# Altium project ZynQ-Feather r0.2.PrjPCB (part 1 of 2)
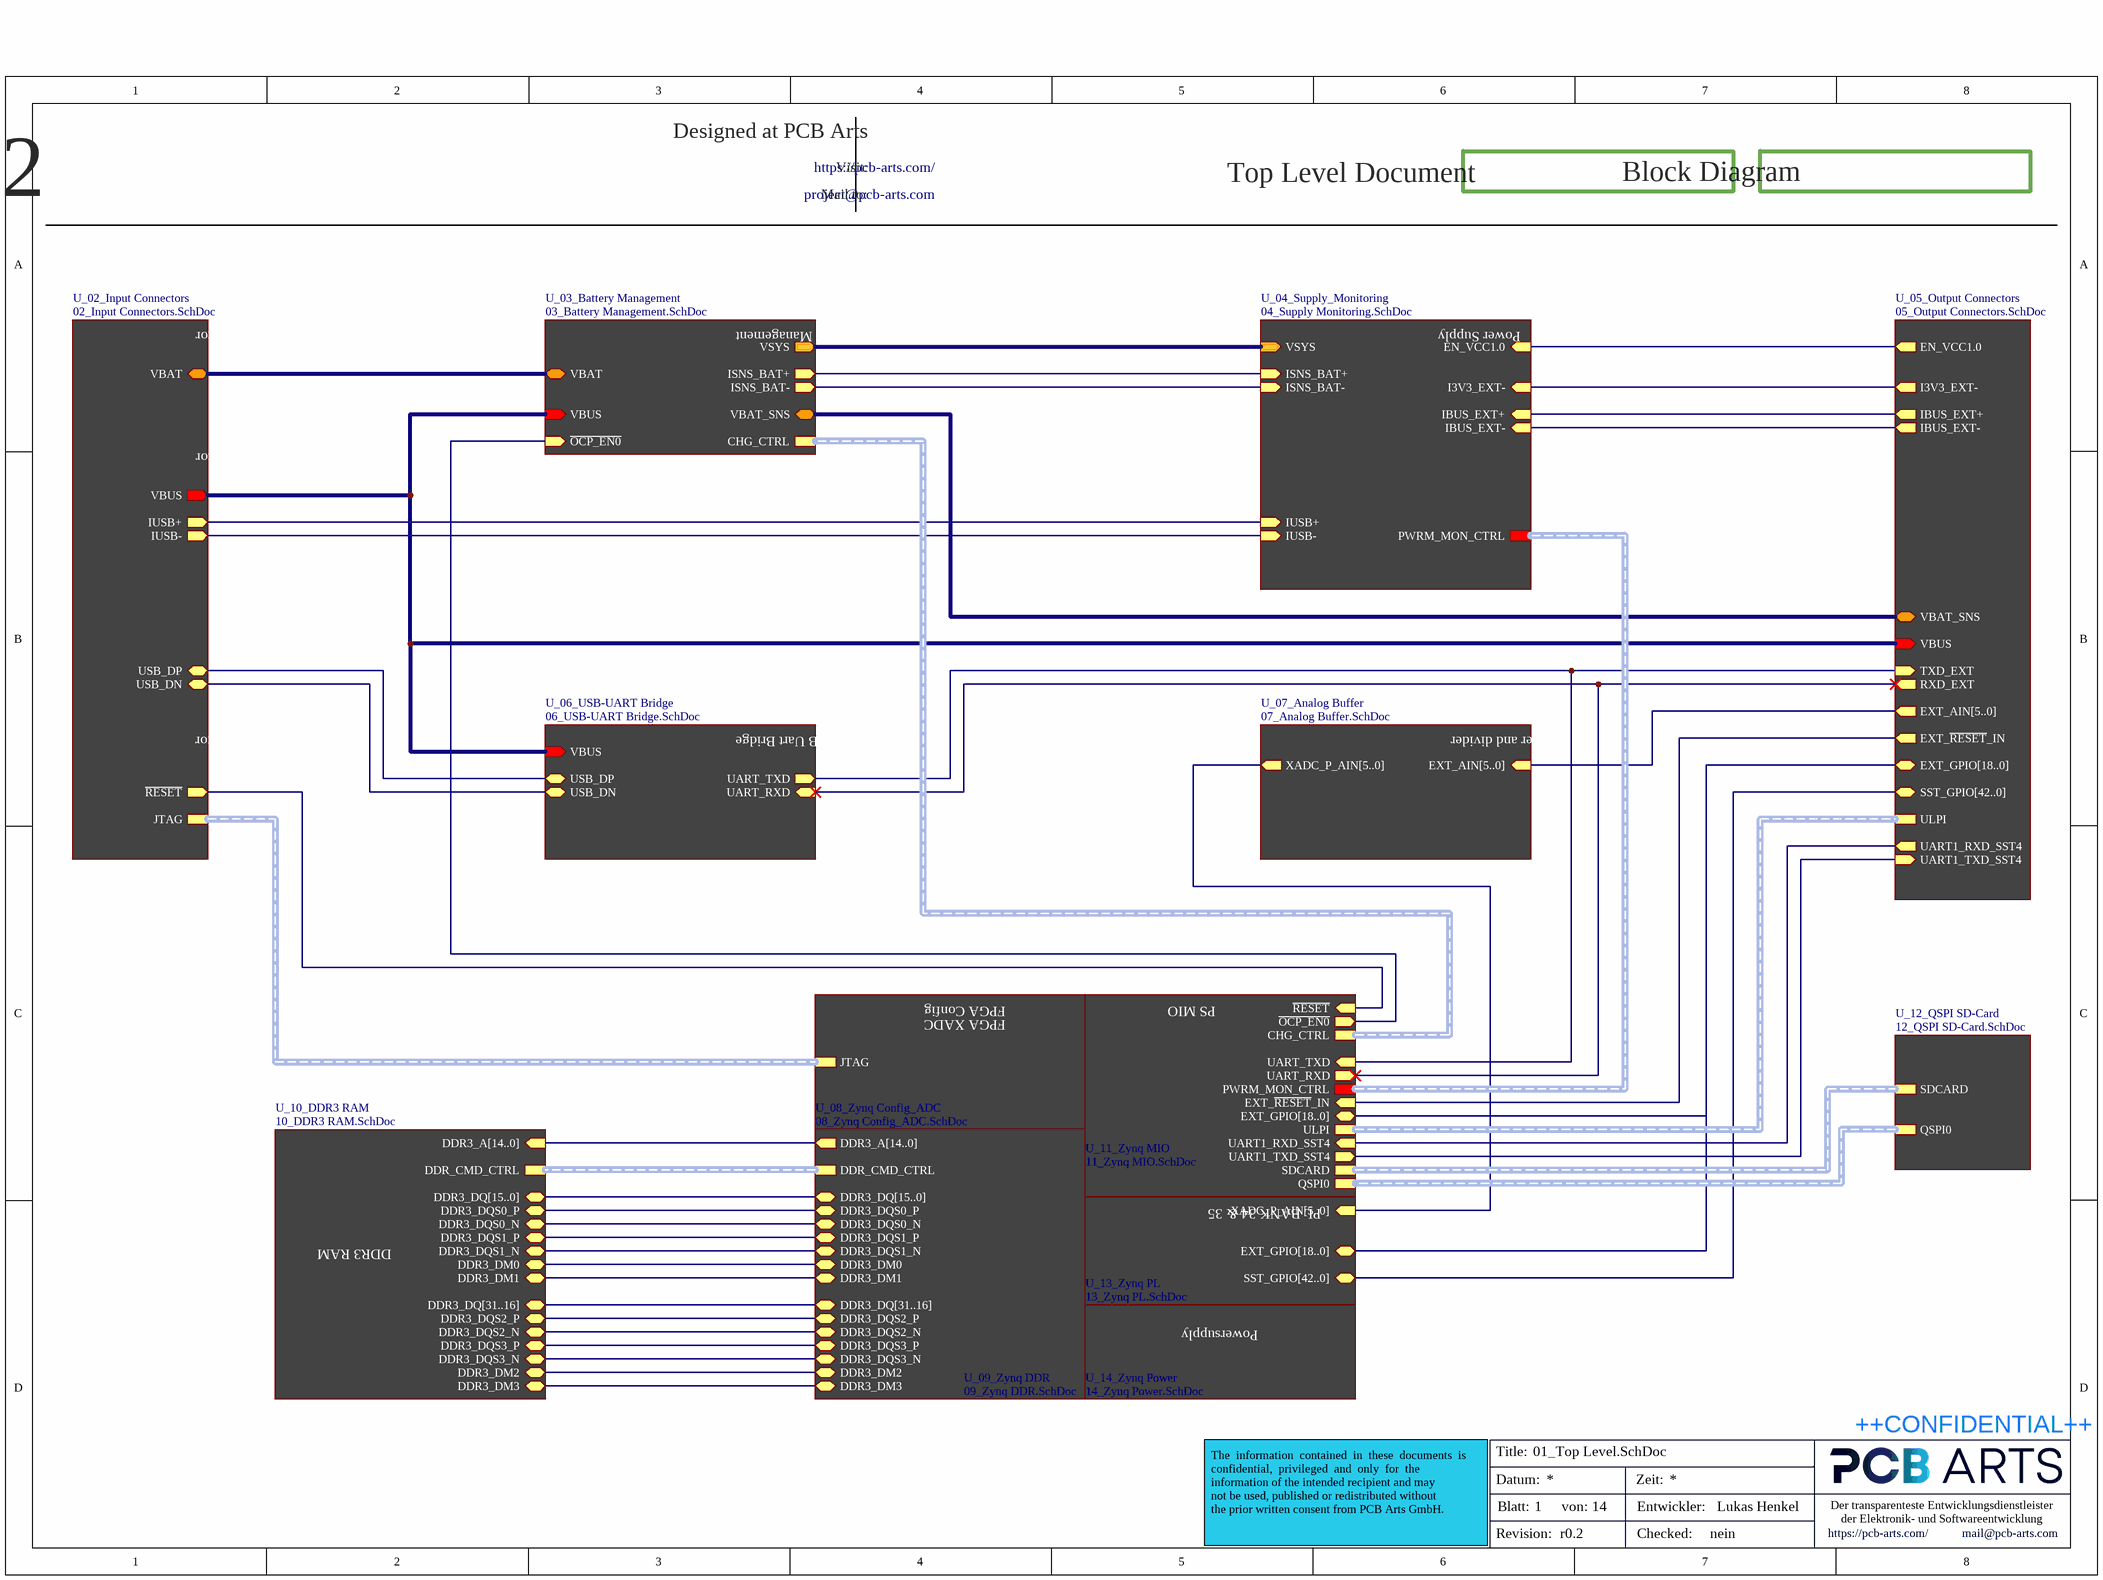
[diagram p0: 01_Top Level.SchDoc]
Checked: nein; Entwickler: Lukas Henkel; Revision1: r0.2
14 sheets, 293 parts. Net scope: hierarchical (ports join the sheet entries above them; power ports are global).
Board files: Zynq Feather r0.2.PcbDoc, Zynq Feather r0.2 Panel.PcbDoc
Sheets:
  01_Top Level.SchDoc
    U_02_Input Connectors = 02_Input Connectors.SchDoc
    U_03_Battery Management = 03_Battery Management.SchDoc
    U_04_Supply_Monitoring = 04_Supply Monitoring.SchDoc
    U_05_Output Connectors = 05_Output Connectors.SchDoc
    U_06_USB-UART Bridge = 06_USB-UART Bridge.SchDoc
    U_07_Analog Buffer = 07_Analog Buffer.SchDoc
    U_08_Zynq Config_ADC = 08_Zynq Config_ADC.SchDoc
    U_09_Zynq DDR = 09_Zynq DDR.SchDoc
    U_10_DDR3 RAM = 10_DDR3 RAM.SchDoc
    U_12_QSPI SD-Card = 12_QSPI SD-Card.SchDoc
    U_11_Zynq MIO = 11_Zynq MIO.SchDoc
    U_13_Zynq PL = 13_Zynq PL.SchDoc
    U_14_Zynq Power = 14_Zynq Power.SchDoc

## Sheet 01_Top Level.SchDoc
size A3; SheetNumber: 1; SheetTotal: 14

### Sub-sheets
U_02_Input Connectors = 02_Input Connectors.SchDoc: USB_DP (bidir), USB_DN (bidir), VBUS (out), VBAT (bidir), JTAG (harness JTAG), IUSB- (out), IUSB+ (out), ~{RESET} (out)
U_03_Battery Management = 03_Battery Management.SchDoc: VBUS (in), VBAT (bidir), VSYS (out), ISNS_BAT+ (out), ISNS_BAT- (out), VBAT_SNS (bidir), CHG_CTRL (harness CHG_CTRL), ~{OCP_EN0} (in)
U_04_Supply_Monitoring = 04_Supply Monitoring.SchDoc: EN_VCC1.0 (in), VSYS (in), PWRM_MON_CTRL (harness PWRM_MON_CTRL), ISNS_BAT+ (in), ISNS_BAT- (in), IBUS_EXT+ (in), IBUS_EXT- (in), IUSB- (in), IUSB+ (in), I3V3_EXT- (in)
U_05_Output Connectors = 05_Output Connectors.SchDoc: I3V3_EXT- (out), VBUS (in), IBUS_EXT+ (out), IBUS_EXT- (out), EN_VCC1.0 (out), VBAT_SNS (bidir), EXT_~{RESET}_IN (out), RXD_EXT (out), TXD_EXT (in), EXT_GPIO[18..0] (bidir), EXT_AIN[5..0] (out), SST_GPIO[42..0] (bidir), ULPI (harness ULPI), UART1_RXD_SST4 (out), UART1_TXD_SST4 (in)
U_06_USB-UART Bridge = 06_USB-UART Bridge.SchDoc: USB_DP (bidir), USB_DN (bidir), UART_TXD (out), UART_RXD (in), VBUS (in)
U_07_Analog Buffer = 07_Analog Buffer.SchDoc: EXT_AIN[5..0] (in), XADC_P_AIN[5..0] (out)
U_08_Zynq Config_ADC = 08_Zynq Config_ADC.SchDoc: JTAG (harness JTAG)
U_09_Zynq DDR = 09_Zynq DDR.SchDoc: DDR3_DQ[15..0] (bidir), DDR3_DQ[31..16] (bidir), DDR3_DQS0_P (bidir), DDR3_DQS0_N (bidir), DDR3_DQS1_P (bidir), DDR3_DQS1_N (bidir), DDR3_DQS2_P (bidir), DDR3_DQS2_N (bidir), DDR3_DQS3_P (bidir), DDR3_DQS3_N (bidir), DDR3_DM0 (bidir), DDR3_DM1 (bidir), DDR3_DM2 (bidir), DDR3_DM3 (bidir), DDR3_A[14..0] (out), DDR_CMD_CTRL (harness DDR_CMD_CTRL)
U_10_DDR3 RAM = 10_DDR3 RAM.SchDoc: DDR3_A[14..0] (in), DDR3_DQ[15..0] (bidir), DDR3_DQ[31..16] (bidir), DDR3_DQS0_P (bidir), DDR3_DQS0_N (bidir), DDR3_DQS1_P (bidir), DDR3_DQS1_N (bidir), DDR3_DQS2_P (bidir), DDR3_DQS2_N (bidir), DDR3_DQS3_P (bidir), DDR3_DQS3_N (bidir), DDR3_DM0 (bidir), DDR3_DM1 (bidir), DDR3_DM2 (bidir), DDR3_DM3 (bidir), DDR_CMD_CTRL (harness DDR_CMD_CTRL)
U_11_Zynq MIO = 11_Zynq MIO.SchDoc: ~{RESET} (in), UART_TXD (in), UART_RXD (out), PWRM_MON_CTRL (harness PWRM_MON_CTRL), EXT_~{RESET}_IN (in), EXT_GPIO[18..0] (bidir), SDCARD (harness SDCARD), QSPI0 (harness QSPI0), ULPI (harness ULPI), UART1_RXD_SST4 (in), UART1_TXD_SST4 (out), CHG_CTRL (harness CHG_CTRL), ~{OCP_EN0} (out)
U_12_QSPI SD-Card = 12_QSPI SD-Card.SchDoc: SDCARD (harness SDCARD), QSPI0 (harness QSPI0)
U_13_Zynq PL = 13_Zynq PL.SchDoc: EXT_GPIO[18..0] (bidir), XADC_P_AIN[5..0] (in), SST_GPIO[42..0] (bidir)
U_14_Zynq Power = 14_Zynq Power.SchDoc: no entries

### Nets
VSYS: sheet U_03_Battery Management/VSYS, sheet U_04_Supply_Monitoring/VSYS
DDR3_DM0: sheet U_09_Zynq DDR/DDR3_DM0, sheet U_10_DDR3 RAM/DDR3_DM0
DDR3_DM1: sheet U_09_Zynq DDR/DDR3_DM1, sheet U_10_DDR3 RAM/DDR3_DM1
DDR3_DM2: sheet U_09_Zynq DDR/DDR3_DM2, sheet U_10_DDR3 RAM/DDR3_DM2
DDR3_DM3: sheet U_09_Zynq DDR/DDR3_DM3, sheet U_10_DDR3 RAM/DDR3_DM3
DDR3_DQS0_N: sheet U_09_Zynq DDR/DDR3_DQS0_N, sheet U_10_DDR3 RAM/DDR3_DQS0_N
DDR3_DQS0_P: sheet U_09_Zynq DDR/DDR3_DQS0_P, sheet U_10_DDR3 RAM/DDR3_DQS0_P
DDR3_DQS1_N: sheet U_09_Zynq DDR/DDR3_DQS1_N, sheet U_10_DDR3 RAM/DDR3_DQS1_N
DDR3_DQS1_P: sheet U_09_Zynq DDR/DDR3_DQS1_P, sheet U_10_DDR3 RAM/DDR3_DQS1_P
DDR3_DQS2_N: sheet U_09_Zynq DDR/DDR3_DQS2_N, sheet U_10_DDR3 RAM/DDR3_DQS2_N
DDR3_DQS2_P: sheet U_09_Zynq DDR/DDR3_DQS2_P, sheet U_10_DDR3 RAM/DDR3_DQS2_P
DDR3_DQS3_N: sheet U_09_Zynq DDR/DDR3_DQS3_N, sheet U_10_DDR3 RAM/DDR3_DQS3_N
DDR3_DQS3_P: sheet U_09_Zynq DDR/DDR3_DQS3_P, sheet U_10_DDR3 RAM/DDR3_DQS3_P
EN_VCC1.0: sheet U_04_Supply_Monitoring/EN_VCC1.0, sheet U_05_Output Connectors/EN_VCC1.0
EXT_~{RESET}_IN: sheet U_05_Output Connectors/EXT_~{RESET}_IN, sheet U_11_Zynq MIO/EXT_~{RESET}_IN
~{OCP_EN0}: sheet U_03_Battery Management/~{OCP_EN0}, sheet U_11_Zynq MIO/~{OCP_EN0}
~{RESET}: sheet U_02_Input Connectors/~{RESET}, sheet U_11_Zynq MIO/~{RESET}
UART1_RXD_SST4: sheet U_05_Output Connectors/UART1_RXD_SST4, sheet U_11_Zynq MIO/UART1_RXD_SST4
UART1_TXD_SST4: sheet U_05_Output Connectors/UART1_TXD_SST4, sheet U_11_Zynq MIO/UART1_TXD_SST4
UART_RXD: sheet U_05_Output Connectors/RXD_EXT, sheet U_06_USB-UART Bridge/UART_RXD, sheet U_11_Zynq MIO/UART_RXD
UART_TXD: sheet U_05_Output Connectors/TXD_EXT, sheet U_06_USB-UART Bridge/UART_TXD, sheet U_11_Zynq MIO/UART_TXD
USB_D_N: sheet U_02_Input Connectors/USB_DN, sheet U_06_USB-UART Bridge/USB_DN
USB_D_P: sheet U_02_Input Connectors/USB_DP, sheet U_06_USB-UART Bridge/USB_DP
VBAT: sheet U_02_Input Connectors/VBAT, sheet U_03_Battery Management/VBAT, sheet U_03_Battery Management/ISNS_BAT-, sheet U_04_Supply_Monitoring/ISNS_BAT-
NetC2_1: sheet U_02_Input Connectors/VBUS, sheet U_02_Input Connectors/IUSB-, sheet U_03_Battery Management/VBUS, sheet U_04_Supply_Monitoring/IBUS_EXT+, sheet U_04_Supply_Monitoring/IUSB-, sheet U_05_Output Connectors/VBUS, sheet U_05_Output Connectors/IBUS_EXT+, sheet U_06_USB-UART Bridge/VBUS
NetC23_1: sheet U_04_Supply_Monitoring/I3V3_EXT-, sheet U_05_Output Connectors/I3V3_EXT-
NetC24_1: sheet U_04_Supply_Monitoring/IBUS_EXT-, sheet U_05_Output Connectors/IBUS_EXT-
NetJ4_28: sheet U_03_Battery Management/ISNS_BAT+, sheet U_03_Battery Management/VBAT_SNS, sheet U_04_Supply_Monitoring/ISNS_BAT+, sheet U_05_Output Connectors/VBAT_SNS
NetL1_1: sheet U_02_Input Connectors/IUSB+, sheet U_04_Supply_Monitoring/IUSB+

### Buses and harness runs
bus sheet U_05_Output Connectors/EXT_AIN[5..0] = sheet U_07_Analog Buffer/EXT_AIN[5..0]
bus sheet U_05_Output Connectors/EXT_GPIO[18..0] = sheet U_11_Zynq MIO/EXT_GPIO[18..0] = sheet U_13_Zynq PL/EXT_GPIO[18..0]
bus sheet U_05_Output Connectors/SST_GPIO[42..0] = sheet U_13_Zynq PL/SST_GPIO[42..0]
bus sheet U_07_Analog Buffer/XADC_P_AIN[5..0] = sheet U_13_Zynq PL/XADC_P_AIN[5..0]
bus sheet U_09_Zynq DDR/DDR3_A[14..0] = sheet U_10_DDR3 RAM/DDR3_A[14..0]
bus sheet U_09_Zynq DDR/DDR3_DQ[15..0] = sheet U_10_DDR3 RAM/DDR3_DQ[15..0]
bus sheet U_09_Zynq DDR/DDR3_DQ[31..16] = sheet U_10_DDR3 RAM/DDR3_DQ[31..16]
harness sheet U_02_Input Connectors/JTAG = sheet U_08_Zynq Config_ADC/JTAG
harness sheet U_03_Battery Management/CHG_CTRL = sheet U_11_Zynq MIO/CHG_CTRL
harness sheet U_04_Supply_Monitoring/PWRM_MON_CTRL = sheet U_11_Zynq MIO/PWRM_MON_CTRL
harness sheet U_05_Output Connectors/ULPI = sheet U_11_Zynq MIO/ULPI
harness sheet U_09_Zynq DDR/DDR_CMD_CTRL = sheet U_10_DDR3 RAM/DDR_CMD_CTRL
harness sheet U_11_Zynq MIO/QSPI0 = sheet U_12_QSPI SD-Card/QSPI0
harness sheet U_11_Zynq MIO/SDCARD = sheet U_12_QSPI SD-Card/SDCARD

### Notes on the sheet
- Zynq Feather Rev. 0.2
- Designed at PCB Arts
- Mail to:
- Visit:
- https://pcb-arts.com/
- project@pcb-arts.com
- Top Level Document
- Block Diagram
- Battery Connector
- Battery Management
- Power Supply
- USB-C Connector
- JTAG Connector
- USB Uart Bridge
- Buffer and divider
- FPGA Config
- FPGA XADC
- PS MIO
- DDR3 RAM
- PL BANK 34 & 35
- Powersupply
- Title:
- ++CONFIDENTIAL++
- Datum:
- Blatt:
- von:
- Zeit:
- Entwickler:
- Der transparenteste Entwicklungsdienstleister
  der Elektronik- und Softwareentwicklung
- The  information  contained  in  these  documents  is  confidential,  privileged  and  only  for  the
  information of the intended recipient and may
  not be used, published or redistributed without
  the prior written consent from PCB Arts GmbH.
- Revision:
- Checked:
- mail@pcb-arts.com

## Sheet 02_Input Connectors.SchDoc
size A3; SheetNumber: 2; SheetTotal: 14
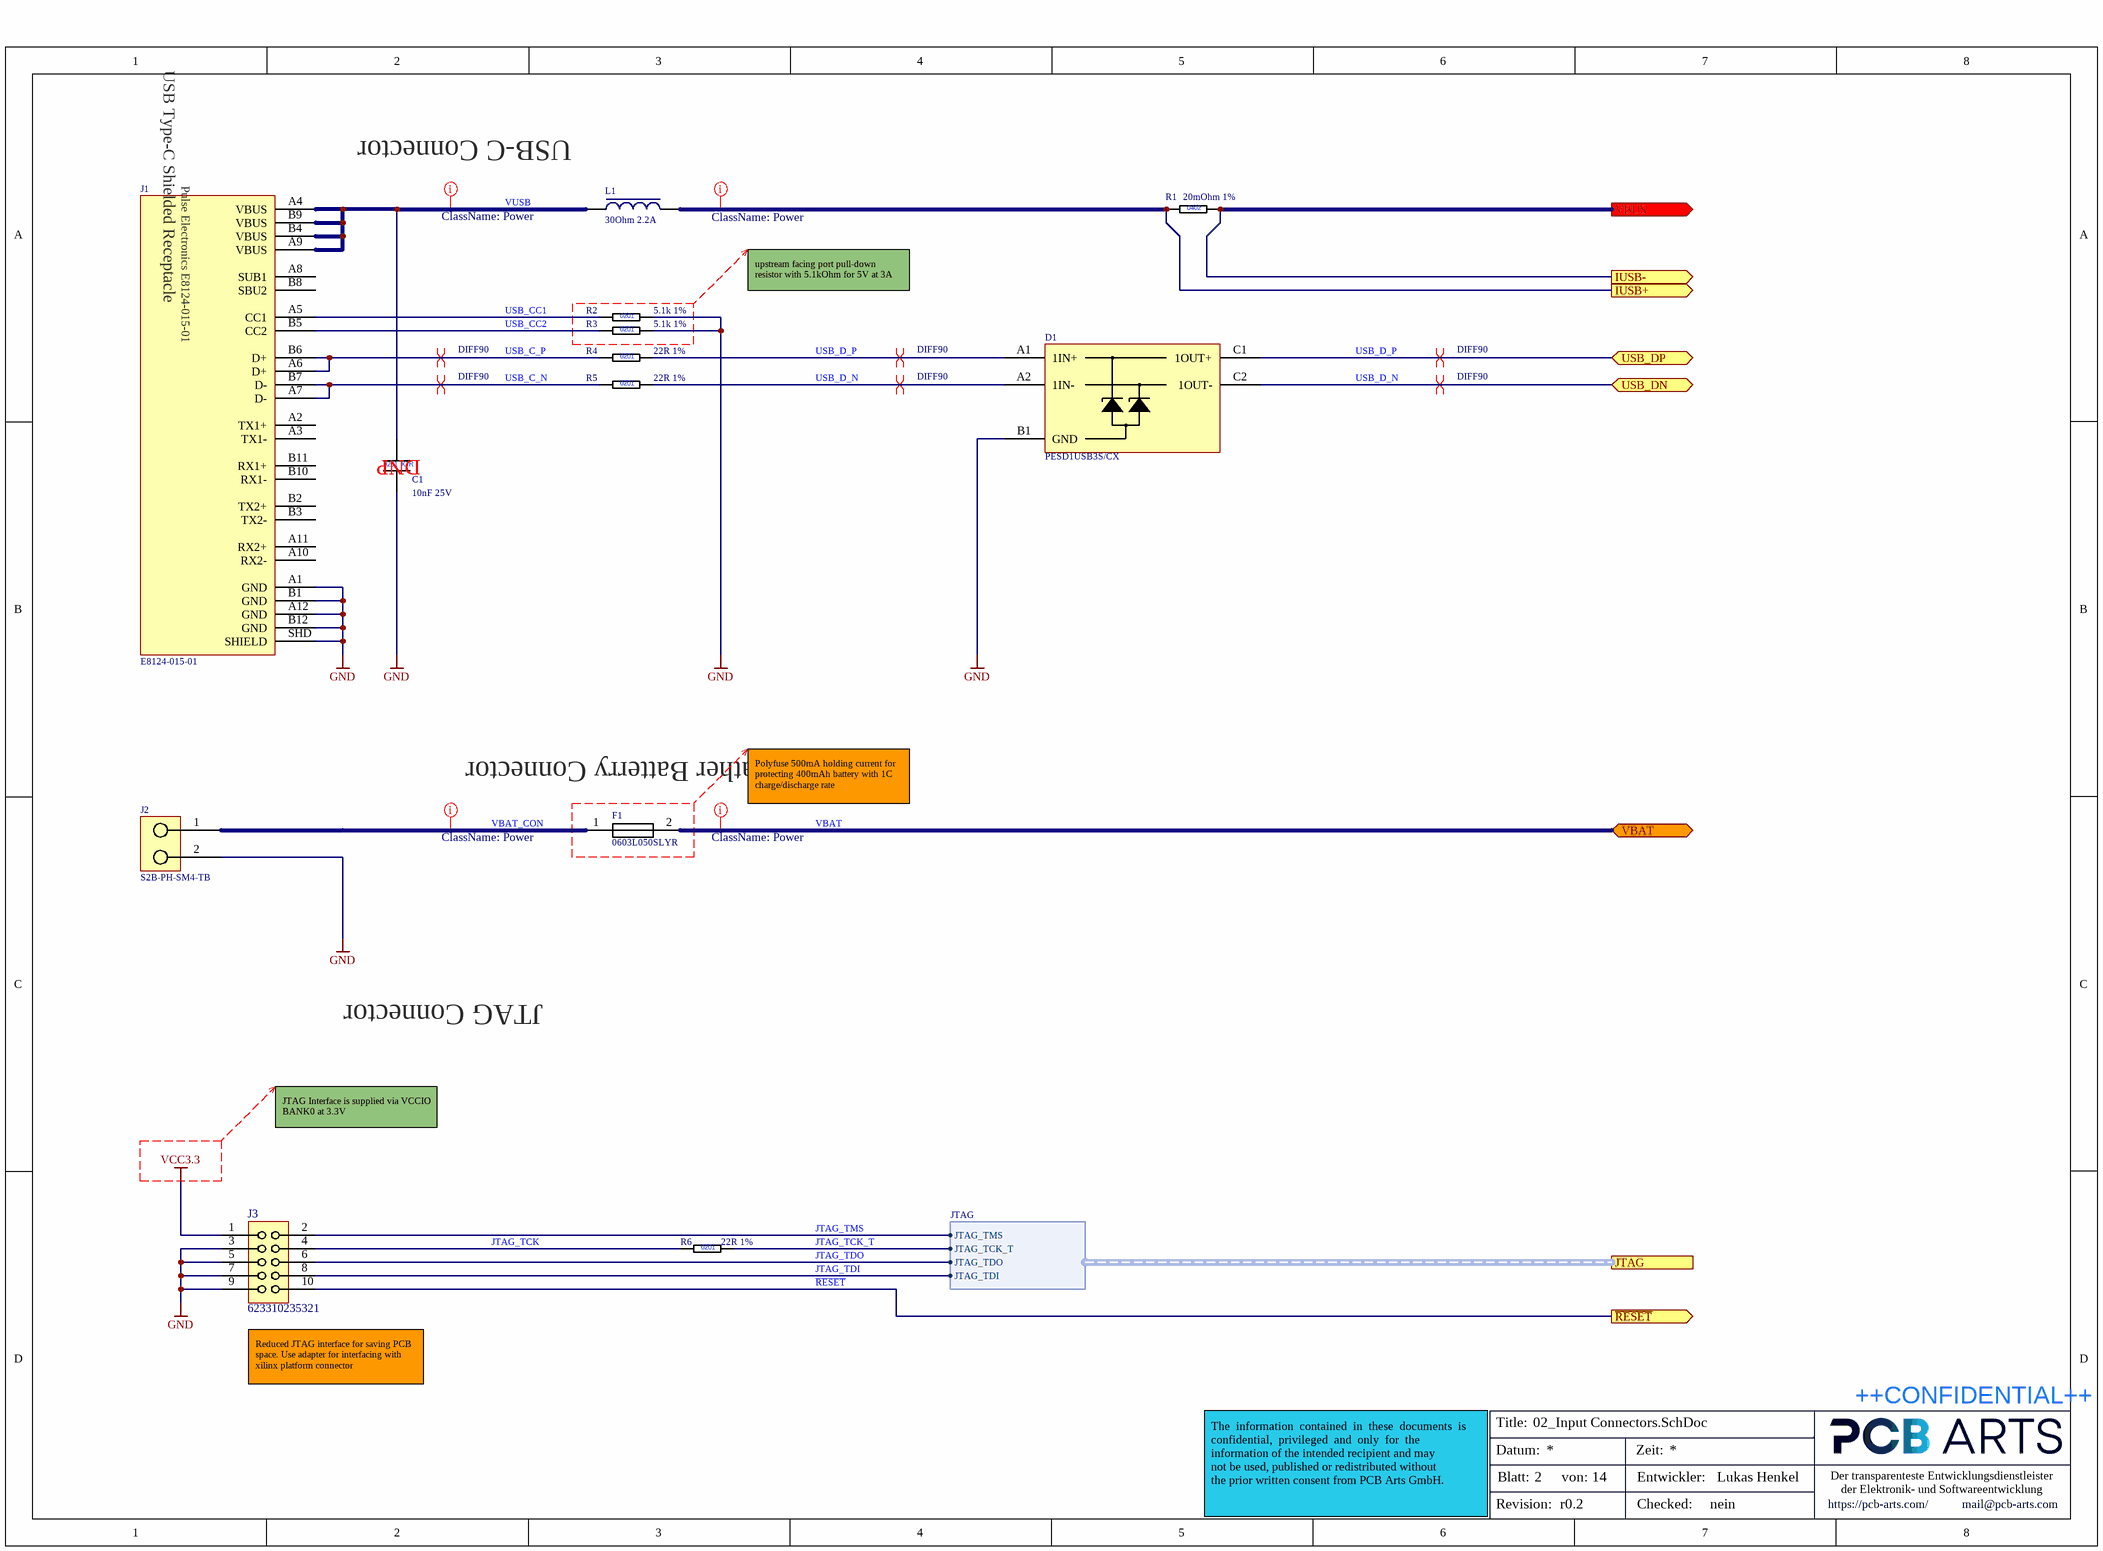
[diagram p1: 02_Input Connectors.SchDoc]

### Parts
C1  10nF 25V  [CAPC0603X03L]
D1  PESD1USB3S/CX  [BGAS5C40P2X3_77X117X60]
F1  0603L050SLYR  [0603L050SLYR]
J1  E8124-015-01  [E8124-015-01]
J2  S2B-PH-SM4-TB  [S2B-PH-SM4-TB]
J3  623310235321  [623310235321_NBE]
L1  30Ohm 2.2A  [INDC1005X06L]
R1  20mOhm 1%  [RESC1005X04L]
R2  5.1k 1%  [RESC0603X03L]
R3  5.1k 1%  [RESC0603X03L]
R4  22R 1%  [RESC0603X03L]
R5  22R 1%  [RESC0603X03L]
R6  22R 1%  [RESC0603X03L]

### Ports
IUSB+ (out), IUSB- (out), JTAG (harness JTAG), USB_DN (bidir), USB_DP (bidir), VBAT (bidir), VBUS (out), ~{RESET} (out)

### Harnesses
JTAG: JTAG_TMS, JTAG_TDO, JTAG_TDI, JTAG_TCK_T

### Nets
GND: C1.2 D1.B1(GND) J1.A1(GND) J1.A12(GND) J1.B1(GND) J1.B12(GND) J1.SHD(SHIELD) J2.2 J3.3 J3.5 J3.7 J3.9 R2.2 R3.2
VCC3.3: J3.1
JTAG_TCK: J3.4 R6.1
JTAG_TCK_T: R6.2 ; port JTAG.JTAG_TCK_T
JTAG_TDI: J3.8 ; port JTAG.JTAG_TDI
JTAG_TDO: J3.6 ; port JTAG.JTAG_TDO
JTAG_TMS: J3.2 ; port JTAG.JTAG_TMS
~{RESET}: J3.10 ; port ~{RESET}
USB_C_N: J1.A7(D-) J1.B7(D-) R5.1
USB_C_P: J1.A6(D+) J1.B6(D+) R4.1
USB_CC1: J1.A5(CC1) R2.1
USB_CC2: J1.B5(CC2) R3.1
USB_D_N: D1.A2(1IN-) D1.C2(1OUT-) R5.2 ; port USB_DN
USB_D_P: D1.A1(1IN+) D1.C1(1OUT+) R4.2 ; port USB_DP
VBAT: F1.2 ; port VBAT
VBAT_CON: F1.1 J2.1
VUSB: C1.1 J1.A4(VBUS) J1.A9(VBUS) J1.B4(VBUS) J1.B9(VBUS) L1.2
NetC2_1: R1.2 ; port VBUS, port IUSB-
NetL1_1: L1.1 R1.1 ; port IUSB+

Not connected (* = marked no-connect by the designer): J1 A2(TX1+) A3(TX1-) A8(SUB1) A10(RX2-) A11(RX2+) B2(TX2+) B3(TX2-) B8(SBU2) B10(RX1-) B11(RX1+)

### Layout directives
net class Power: NetL1_1, VBAT, VBAT_CON, VUSB
differential pair; net class DIFF90: USB_C_N, USB_C_P, USB_D_N, USB_D_P

### Notes on the sheet
- (near J1) USB-C Connector
- upstream facing port pull-down resistor with 5.1kOhm for 5V at 3A
- (near C1) DNP
- (near J2) Feather Batterry Connector
- Polyfuse 500mA holding current for protecting 400mAh battery with 1C charge/discharge rate
- JTAG Connector
- JTAG Interface is supplied via VCCIO BANK0 at 3.3V
- (near J3) Reduced JTAG interface for saving PCB space. Use adapter for interfacing with xilinx platform connector
- Title:
- ++CONFIDENTIAL++
- Datum:
- Blatt:
- von:
- Zeit:
- Entwickler:
- Der transparenteste Entwicklungsdienstleister
  der Elektronik- und Softwareentwicklung
- The  information  contained  in  these  documents  is  confidential,  privileged  and  only  for  the
  information of the intended recipient and may
  not be used, published or redistributed without
  the prior written consent from PCB Arts GmbH.
- Revision:
- Checked:
- https://pcb-arts.com/
- mail@pcb-arts.com
- (in symbol CAP_0201_10nF_25V) 0201; X7R
- (in symbol E8124-015-01_USB Type-C Receptacle) USB Type-C Shielded Receptacle; Pulse Electronics E8124-015-01
- (in symbol RES_0201_5.1k_1%) 0201
- (in symbol RES_0201_22R_1%) 0201
- (in symbol RES_0402_20mR_1%) 0402

### Library data of the parts
C1 = CAP_0201_10nF_25V: Multilayer Ceramic Capacitors MLCC - SMD/SMT 0201 25VDC; Manufacturer 1: Murata Electronics; Manufacturer 1 Prt. Nr.: GRM033C81E103KE14D; Manufacturer 2 Prt. Nr.: 02013C103KAT2A; Manufacturer 2: AVX
D1 = PESD1USB3S/CX_ESD Suppressors / TVS Diodes PESD1USB3S/NAX000: ESD Suppressors / TVS Diodes PESD1USB3S/NAX000; Manufacturer 1: Nexperia; Manufacturer 1 Prt. Nr.: PESD1USB3S/CX
F1 = 0603L050SLYR_PPTC 6V POLYFUSE 0603 LoRho SL 0.50A: Resettable Fuses - PPTC 6V POLYFUSE 0603 LoRho SL 0.50A; Manufacturer 1: Littelfuse; Manufacturer 1 Prt. Nr.: 0603L050SLYR
J1 = E8124-015-01_USB Type-C Receptacle: USB-Stecker USB 3.1 TYPE C 10G Top Mount; Manufacturer 1: Pulse Electronics; Manufacturer 1 Prt. Nr.: E8124-015-01
J2 = S2B-PH-SM4-TB JST Automotive 2mm pitch connector: JST Automotive 2mm pitch crimp style connector; Manufacturer 1: JST Sales America Inc.; Manufacturer 1 Prt. Nr.: S2B-PH-SM4-TB
J3 = 623310235321_WR-PHD 1.27 mm SMT Dual Socket Header: WR-PHD 1.27 mm SMT Dual Socket Header, H=2.20 mm; Manufacturer 1: Würth elektronik; Manufacturer 1 Prt. Nr.: 623310235321
L1 = FLT_0402_30Ohm_2.2A: Ferrite Bead 0402 30Ohm 2.2A 25%; Manufacturer Prt. Nr.: BLM15PD300SZ1D; Manufacturer: Murata Electronics
R1 = RES_0402_20mR_1%: Thick Film Resistors - SMD 20mOHM 1%; Manufacturer 1: Yageo; Manufacturer 1 Prt. Nr.: PA0402FRL7T0R02L
R2 R3 = RES_0201_5.1k_1%: Thick Film Resistors - SMD 5.1K OHM 1%; Manufacturer 1: Yageo; Manufacturer 1 Prt. Nr.: RC0201FR-075K1L; Manufacturer 2 Prt. Nr.: CRCW02015K10FKED; Manufacturer 2: Vishay / Dale
R4-R6 = RES_0201_22R_1%: Thick Film Resistors - SMD 22R OHM 1%; Manufacturer 1: Yageo; Manufacturer 1 Prt. Nr.: RC0201FR-0722RL; Manufacturer 2 Prt. Nr.: CRCW020122R0FNED; Manufacturer 2: Vishay / Dale

## Sheet 03_Battery Management.SchDoc
size A3; SheetNumber: 3; SheetTotal: 14
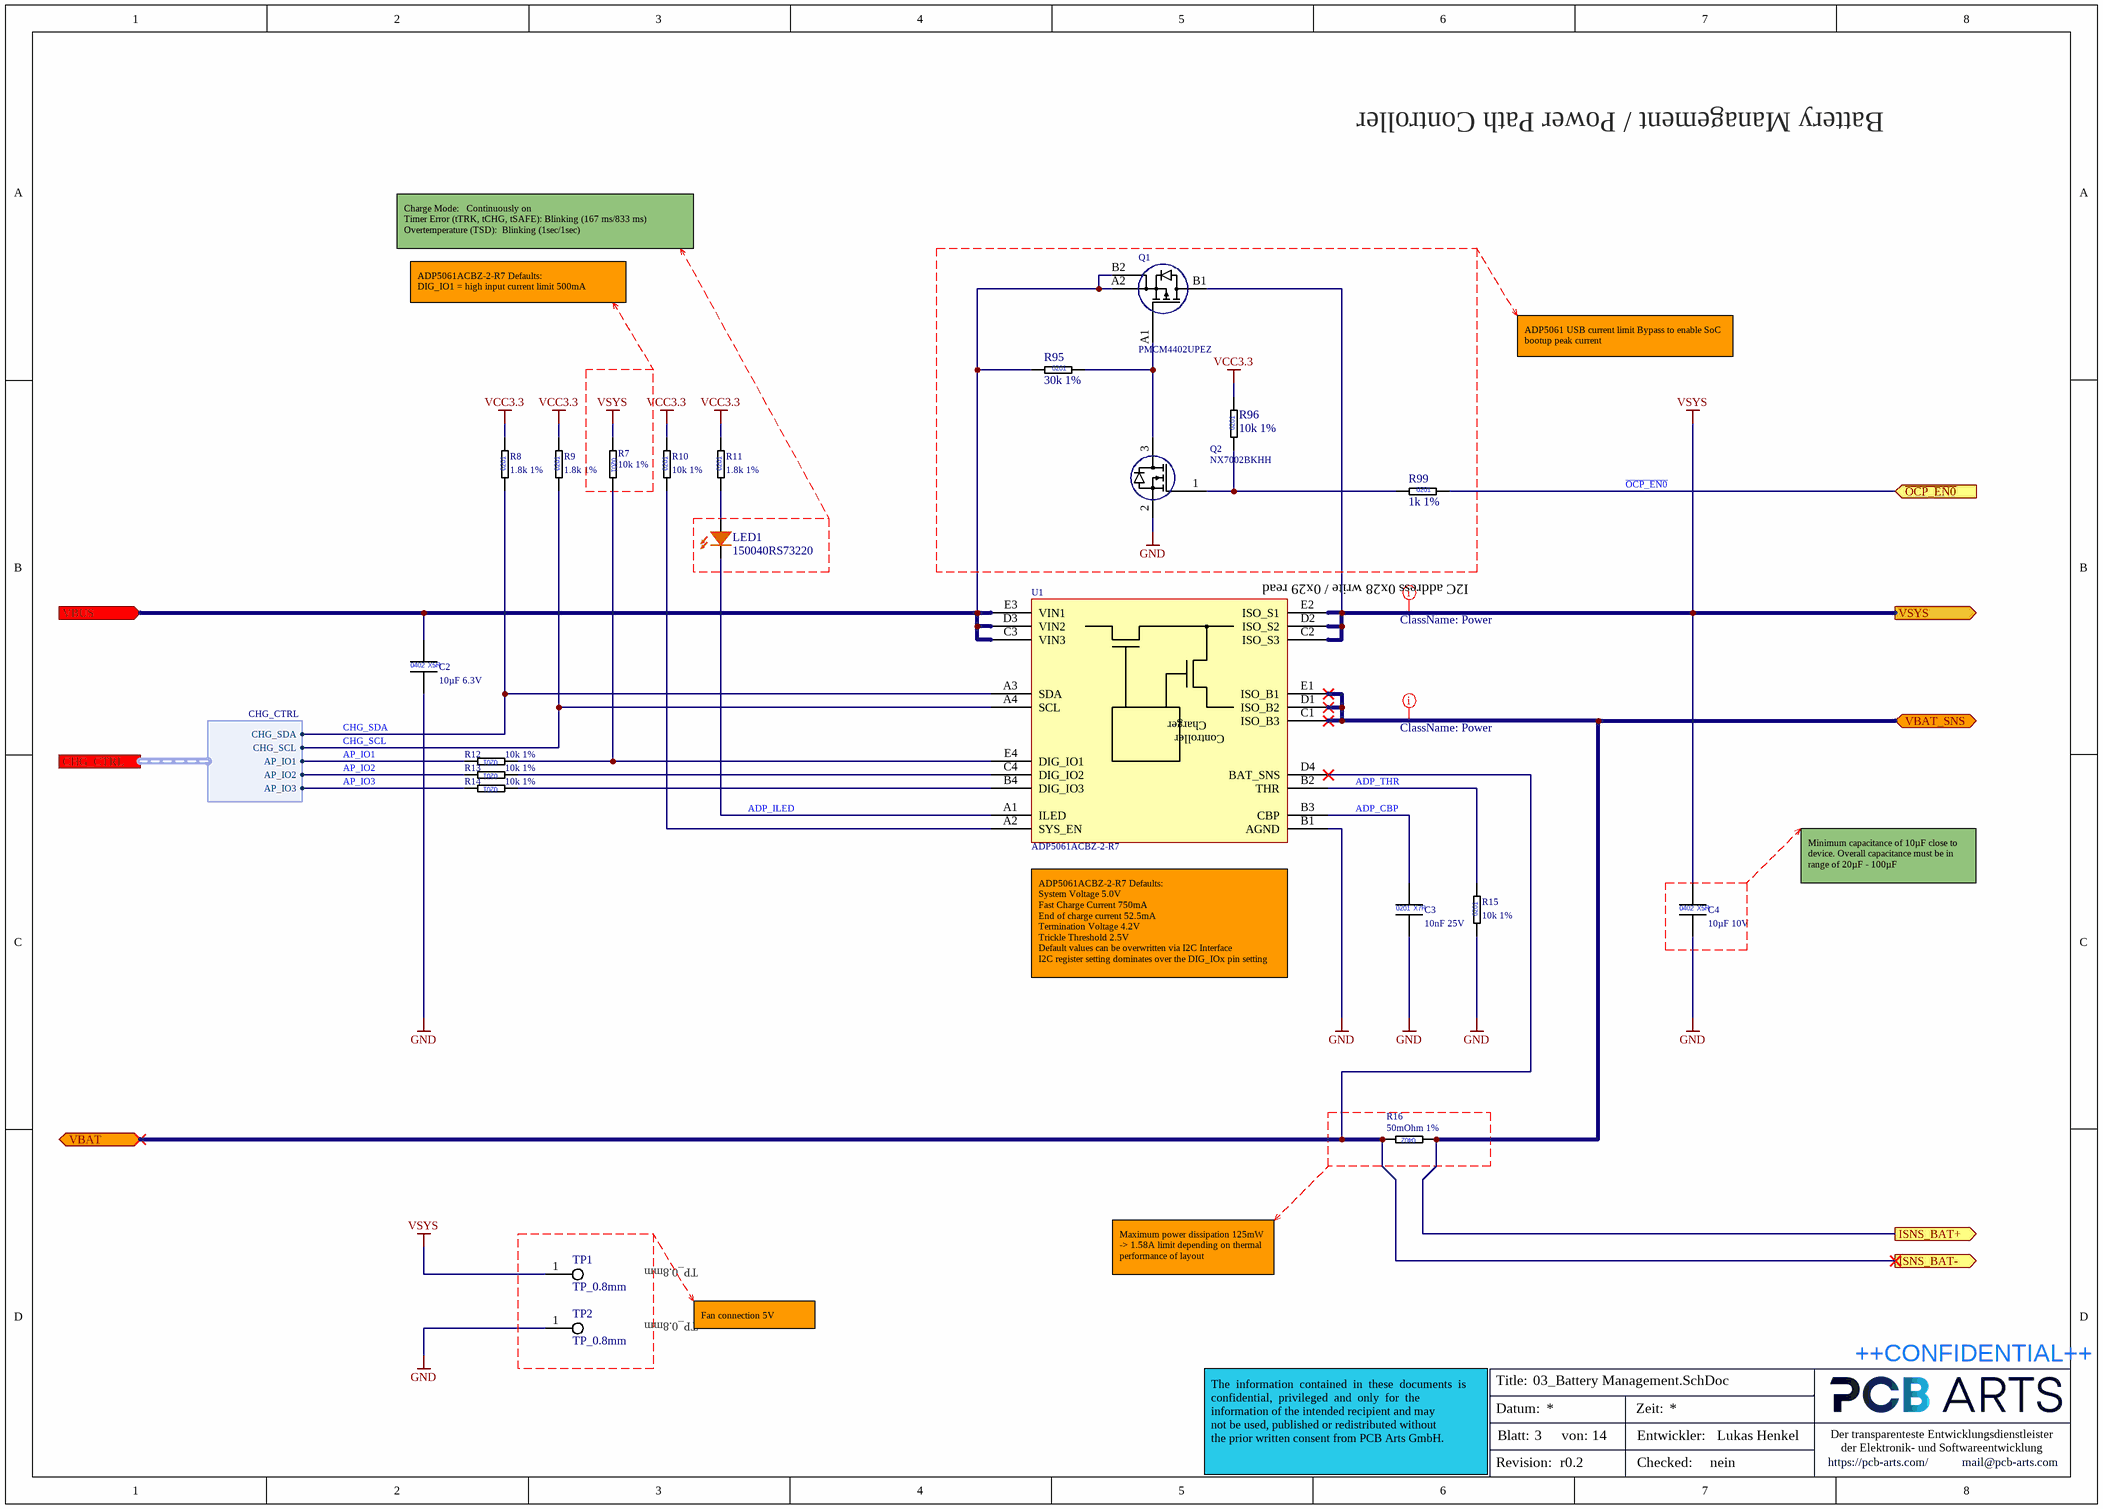
[diagram p2: 03_Battery Management.SchDoc]

### Parts
C2  10µF 6.3V  [CAPC1005X06L]
C3  10nF 25V  [CAPC0603X03L]
C4  10µF 10V  [CAPC1005X06L]
LED1  150040RS73220  [WL-SMCC_0402_H=0.25mm]
Q1  PMCM4402UPEZ  [BGA4C40P2X2_78X78X38]
Q2  NX7002BKHH  [DFN0606-3]
R7  10k 1%  [RESC0603X03L]
R8  1.8k 1%  [RESC0603X03L]
R9  1.8k 1%  [RESC0603X03L]
R10  10k 1%  [RESC0603X03L]
R11  1.8k 1%  [RESC0603X03L]
R12  10k 1%  [RESC0603X03L]
R13  10k 1%  [RESC0603X03L]
R14  10k 1%  [RESC0603X03L]
R15  10k 1%  [RESC0603X03L]
R16  50mOhm 1%  [RESC1005X04L]
R95  30k 1%  [RESC0603X03L]
R96  10k 1%  [RESC0603X03L]
R99  1k 1%  [RESC0603X03L]
TP1  TP_0.8mm  [TP_0.8mm]  (no BOM)
TP2  TP_0.8mm  [TP_0.8mm]  (no BOM)
U1  ADP5061ACBZ-2-R7  [BGA20C50P4X5_200X260X66]

### Ports
CHG_CTRL (harness CHG_CTRL), ISNS_BAT+ (out), ISNS_BAT- (out), VBAT (bidir), VBAT_SNS (bidir), VBUS (in), VSYS (out), ~{OCP_EN0} (in)

### Harnesses
CHG_CTRL: CHG_SDA, CHG_SCL, AP_IO1, AP_IO2, AP_IO3

### Nets
GND: C2.2 C3.2 C4.2 Q2.2(Source) R15.1 TP2.1 U1.B1(AGND)
VCC3.3: R8.2 R9.2 R10.2 R11.2 R96.2
VSYS: C4.1 Q1.B1(Drain) R7.1 TP1.1 U1.C2(ISO_S3) U1.D2(ISO_S2) U1.E2(ISO_S1) ; port VSYS
ADP_CBP: C3.1 U1.B3(CBP)
ADP_ILED: LED1.1 U1.A1(ILED)
ADP_THR: R15.2 U1.B2(THR)
AP_IO1: R12.2 ; port CHG_CTRL.AP_IO1
AP_IO2: R13.2 ; port CHG_CTRL.AP_IO2
AP_IO3: R14.2 ; port CHG_CTRL.AP_IO3
CHG_SCL: R9.1 U1.A4(SCL) ; port CHG_CTRL.CHG_SCL
CHG_SDA: R8.1 U1.A3(SDA) ; port CHG_CTRL.CHG_SDA
~{OCP_EN0}: R99.2 ; port ~{OCP_EN0}
VBAT: R16.2 U1.D4(BAT_SNS) ; port VBAT, port ISNS_BAT-
NetC2_1: C2.1 Q1.A2(Source) Q1.B2(Source) R95.1 U1.C3(VIN3) U1.D3(VIN2) U1.E3(VIN1) ; port VBUS
NetJ4_28: R16.1 U1.C1(ISO_B3) U1.D1(ISO_B2) U1.E1(ISO_B1) ; port ISNS_BAT+, port VBAT_SNS
NetLED1_2: LED1.2 R11.1
NetQ1_A1: Q1.A1(Gate) Q2.3(Drain) R95.2
NetQ2_1: Q2.1(Gate) R96.1 R99.1
NetR7_2: R7.2 R12.1 U1.E4(DIG_IO1)
NetR10_1: R10.1 U1.A2(SYS_EN)
NetR13_1: R13.1 U1.C4(DIG_IO2)
NetR14_1: R14.1 U1.B4(DIG_IO3)

### Layout directives
net class Power: NetJ4_28, VSYS

### Notes on the sheet
- Battery Management / Power Path Controller
- Charge Mode:			Continuously on
  Timer Error (tTRK, tCHG, tSAFE):	Blinking (167 ms/833 ms)
  Overtemperature (TSD):		Blinking (1sec/1sec)
- ADP5061ACBZ-2-R7 Defaults:
  DIG_IO1 = high	input current limit 500mA
- ADP5061 USB current limit Bypass to enable SoC bootup peak current
- (near U1) I2C address 0x28 write / 0x29 read
- Minimum capacitance of 10µF close to device. Overall capacitance must be in range of 20µF - 100µF
- (near U1) ADP5061ACBZ-2-R7 Defaults:
  System Voltage	5.0V
  Fast Charge Current	750mA
  End of charge current	52.5mA
  Termination Voltage	4.2V
  Trickle Threshold	2.5V
  Default values can be overwritten via I2C Interface
  I2C register setting dominates over the DIG_IOx pin setting
- Fan connection 5V
- Maximum power dissipation 125mW
  -> 1.58A limit depending on thermal performance of layout
- Title:
- ++CONFIDENTIAL++
- Datum:
- Blatt:
- von:
- Zeit:
- Entwickler:
- Der transparenteste Entwicklungsdienstleister
  der Elektronik- und Softwareentwicklung
- The  information  contained  in  these  documents  is  confidential,  privileged  and  only  for  the
  information of the intended recipient and may
  not be used, published or redistributed without
  the prior written consent from PCB Arts GmbH.
- Revision:
- Checked:
- https://pcb-arts.com/
- mail@pcb-arts.com
- (in symbol ADP5061ACBZ-2-R7_I2C Programmable, Linear Battery Charger) Charger; Controller
- (in symbol CAP_0201_10nF_25V) 0201; X7R
- (in symbol CAP_0402_10µ_6.3V) 0402; X5R
- (in symbol CAP_0402_10µ_10V) 0402; X5R
- (in symbol RES_0201_1.8k_1%) 0201
- (in symbol RES_0201_1k_1%) 0201
- (in symbol RES_0201_10k_1%) 0201
- (in symbol RES_0201_30k_1%) 0201
- (in symbol RES_0402_50mR_1%) 0402

### Library data of the parts
C2 = CAP_0402_10µ_6.3V: Multilayer Ceramic Capacitors MLCC - SMD/SMT 0402 6.3VDC; Manufacturer 1: Murata Electronics; Manufacturer 1 Prt. Nr.: GRM155C80J106ME11J; Manufacturer 2 Prt. Nr.: JMK105CBJ106MV-F; Manufacturer 2: Taiyo Yuden
C3 = CAP_0201_10nF_25V: as C1 on sheet 02_Input Connectors; Manufacturer 2: AVX
C4 = CAP_0402_10µ_10V: Multilayer Ceramic Capacitors MLCC - SMD/SMT 0402 10VDC; Manufacturer 1: Murata Electronics; Manufacturer 1 Prt. Nr.: GRM155R61A475MEAAD; Manufacturer 2 Prt. Nr.: LMK105BBJ475MVLF; Manufacturer 2: Taiyo Yuden
LED1 = 150040RS73220_SMD WL-SMCC SMT LED Mono-color: Standard LEDs - SMD WL-SMCC SMT LED Mono-color; Manufacturer 1: Wurth Elektronik; Manufacturer 1 Prt. Nr.: 150040RS73220
Q1 = PMCM4402UPEZ_PMOS 20V P-channel Trench MOSFET: 20 V, P-channel Trench MOSFET; Manufacturer 1: Nexperia; Manufacturer 1 Prt. Nr.: PMCM4402UPEZ
Q2 = NX7002BKHH_NMOS 60V N-channel Trench MOSFET: 60 V, N-channel Trench MOSFET 2.8Ohm; Manufacturer 1: Nexperia; Manufacturer 1 Prt. Nr.: NX7002BKHH
R7 R10 R12-R15 R96 = RES_0201_10k_1%: Thick Film Resistors - SMD 10K OHM 1%; Manufacturer 1: Yageo; Manufacturer 1 Prt. Nr.: RC0201FR-0710KL; Manufacturer 2 Prt. Nr.: CRCW020110K0FNED; Manufacturer 2: Vishay / Dale
R8 R9 R11 = RES_0201_1.8k_1%: Thick Film Resistors - SMD 1.8K OHM 1%; Manufacturer 1: Panasonic; Manufacturer 1 Prt. Nr.: ERJ-1GNF1801C; Manufacturer 2 Prt. Nr.: CRCW02011K80FKED; Manufacturer 2: Vishay / Dale
R16 = RES_0402_50mR_1%: Thick Film Resistors - SMD 50mOHM 1%; Manufacturer 1: Panasonic; Manufacturer 1 Prt. Nr.: ERJ-2BWJR051X
R95 = RES_0201_30k_1%: Thick Film Resistors - SMD 30K OHM 1%; Manufacturer 1: Yageo; Manufacturer 1 Prt. Nr.: RC0201JR-0730KL; Manufacturer 2 Prt. Nr.: CRCW020130K0FNED; Manufacturer 2: Vishay / Dale
R99 = RES_0201_1k_1%: Thick Film Resistors - SMD 1K OHM 1%; Manufacturer 1: Yageo; Manufacturer 1 Prt. Nr.: RC0201FR-071KL; Manufacturer 2 Prt. Nr.: CRCW02011K00FNED; Manufacturer 2: Vishay / Dale
TP1 TP2 = TP_0.8mm_Tespoint: Testpoint 0.8mm diameter, with 3D Mark
U1 = ADP5061ACBZ-2-R7_I2C Programmable, Linear Battery Charger: Tiny, I2C Programmable, Linear Battery Charger with Power Path and USB Mode Compatibility; Manufacturer 1: Analog Devices; Manufacturer 1 Prt. Nr.: ADP5061ACBZ-2-R7

## Sheet 04_Supply Monitoring.SchDoc
size A2; SheetNumber: 4; SheetTotal: 14
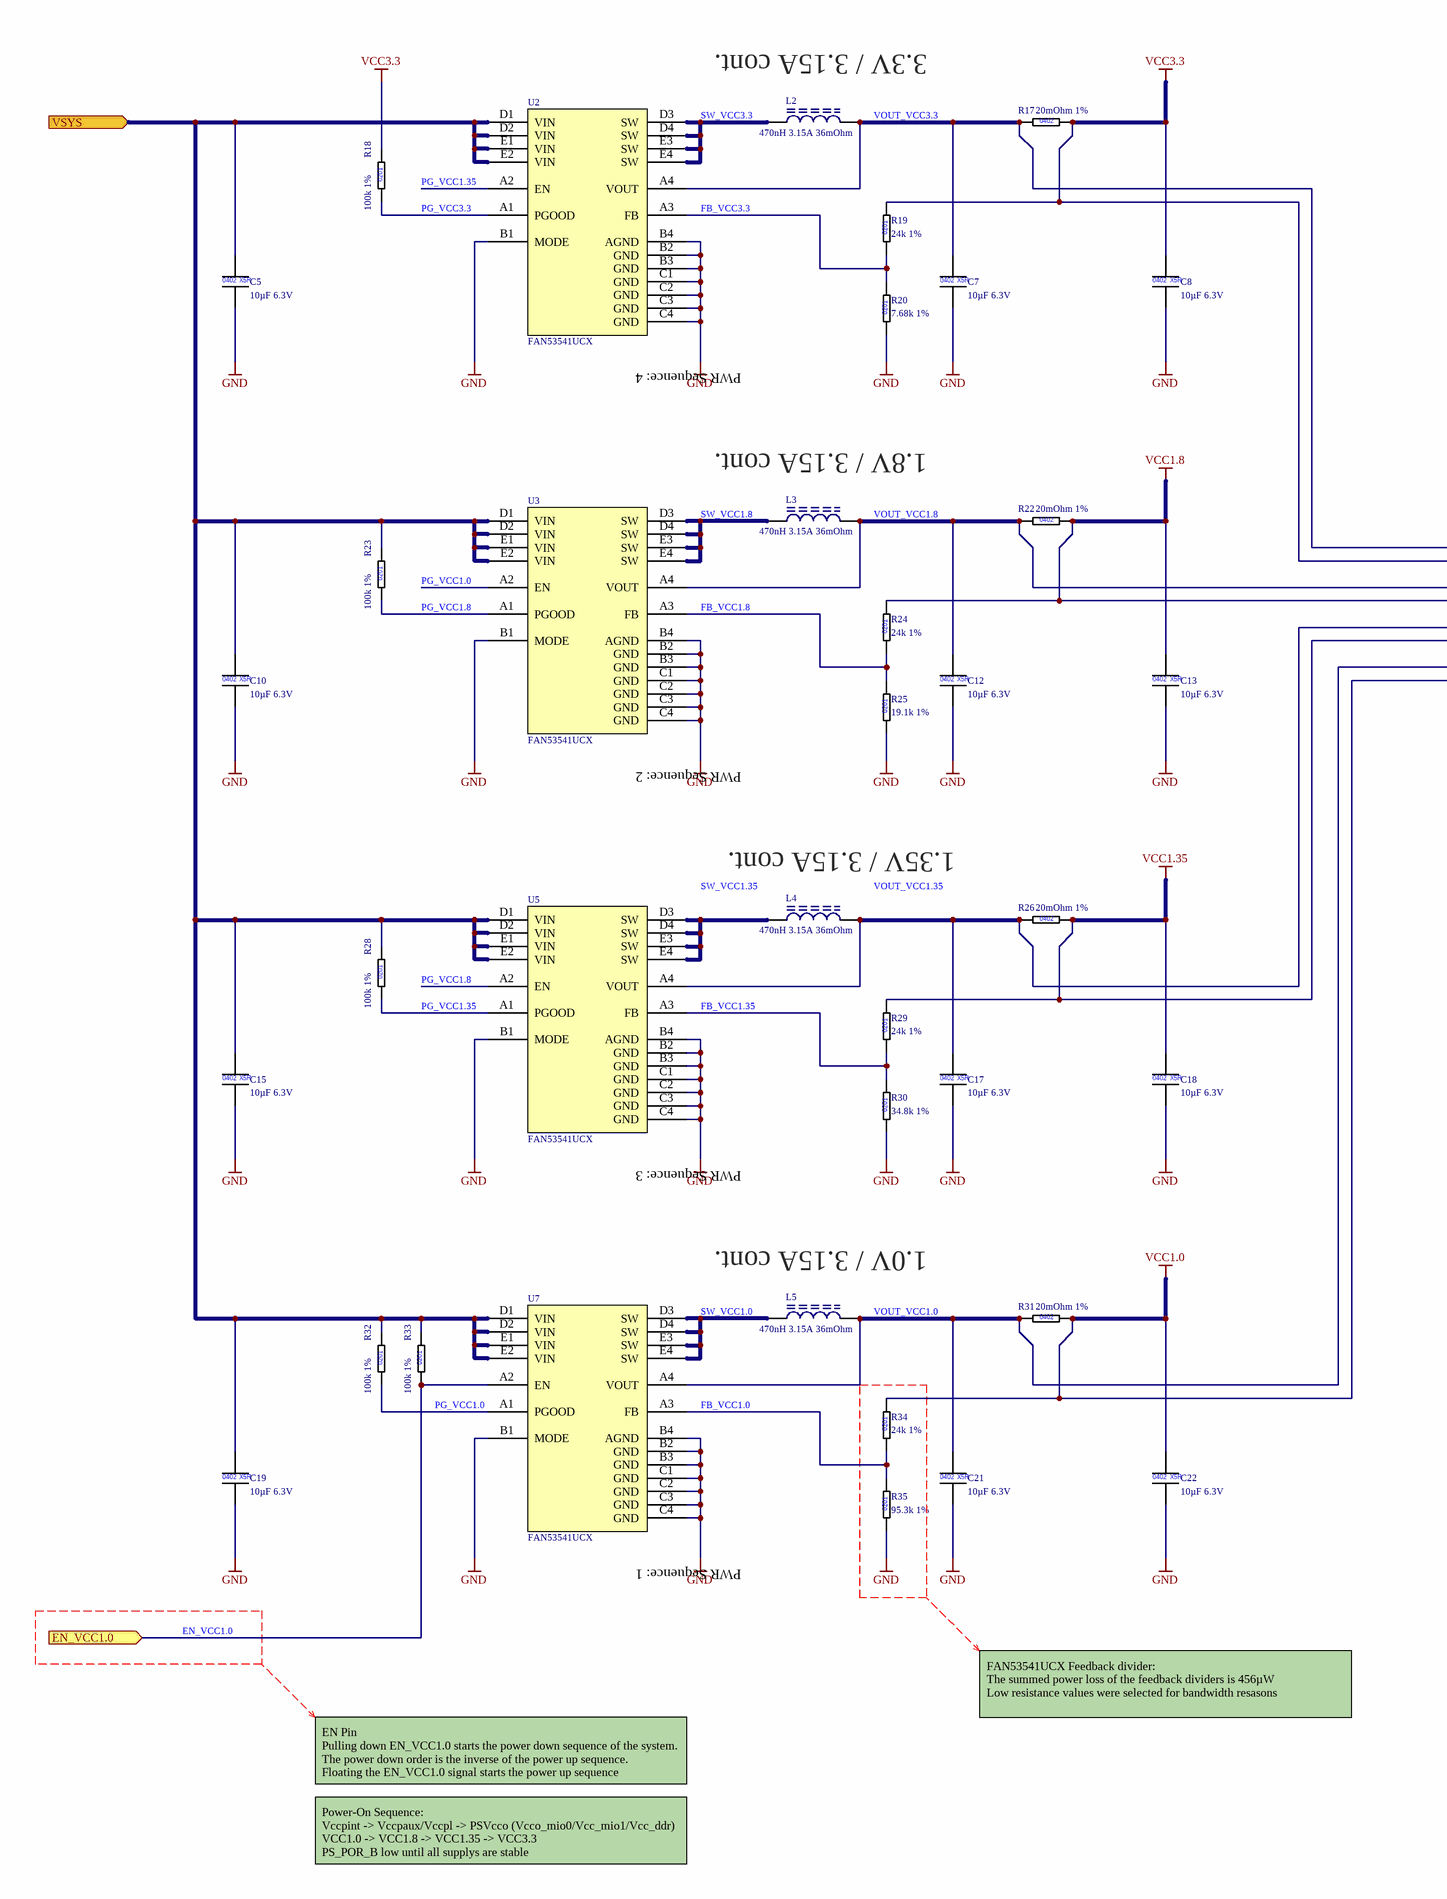
[diagram p3: 04_Supply Monitoring.SchDoc, left]
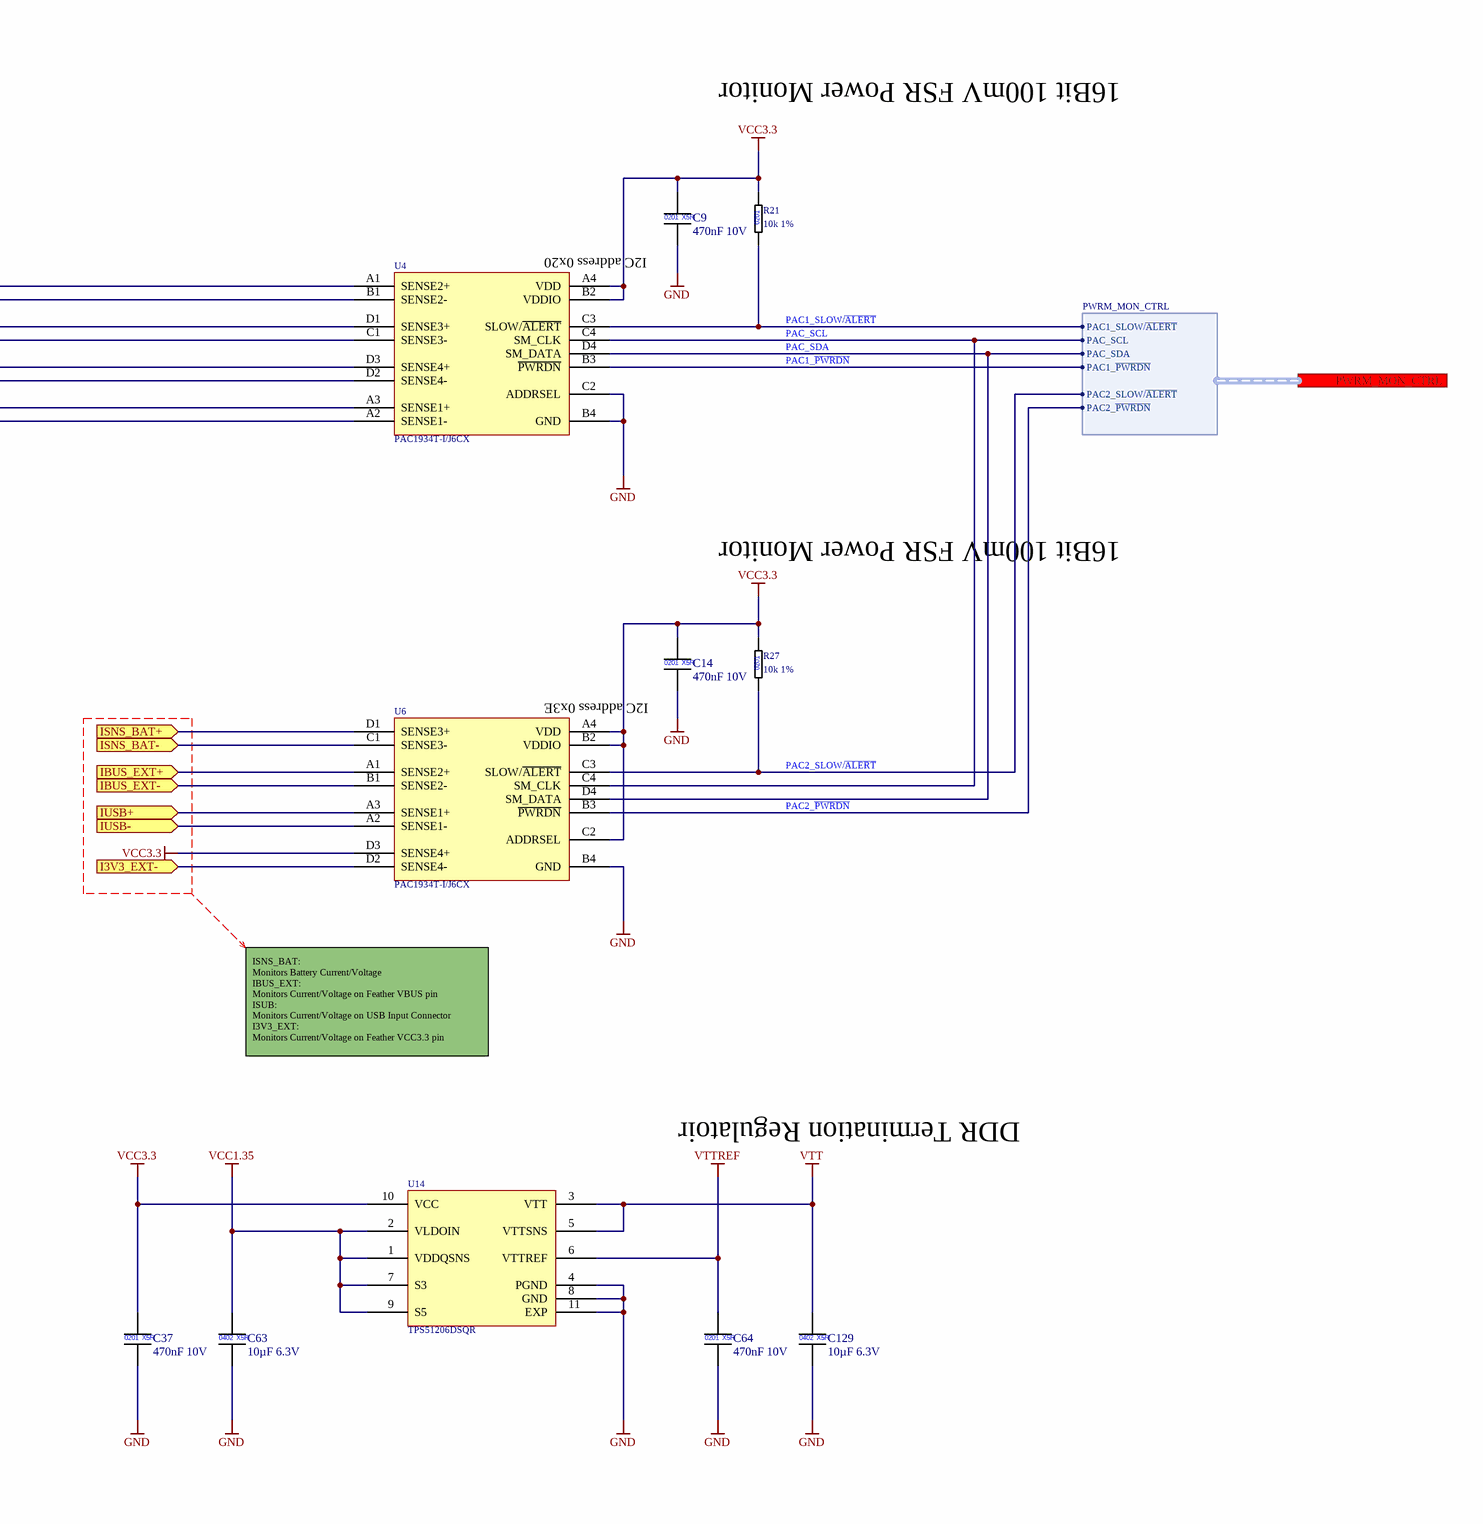
[diagram p4: 04_Supply Monitoring.SchDoc, right]

### Parts
C5  10µF 6.3V  [CAPC1005X06L]
C7  10µF 6.3V  [CAPC1005X06L]
C8  10µF 6.3V  [CAPC1005X06L]
C9  470nF 10V  [CAPC0603X03L]
C10  10µF 6.3V  [CAPC1005X06L]
C12  10µF 6.3V  [CAPC1005X06L]
C13  10µF 6.3V  [CAPC1005X06L]
C14  470nF 10V  [CAPC0603X03L]
C15  10µF 6.3V  [CAPC1005X06L]
C17  10µF 6.3V  [CAPC1005X06L]
C18  10µF 6.3V  [CAPC1005X06L]
C19  10µF 6.3V  [CAPC1005X06L]
C21  10µF 6.3V  [CAPC1005X06L]
C22  10µF 6.3V  [CAPC1005X06L]
C37  470nF 10V  [CAPC0603X03L]
C63  10µF 6.3V  [CAPC1005X06L]
C64  470nF 10V  [CAPC0603X03L]
C129  10µF 6.3V  [CAPC1005X06L]
L2  470nH 3.15A 36mOhm  [INDC2013X08L]
L3  470nH 3.15A 36mOhm  [INDC2013X08L]
L4  470nH 3.15A 36mOhm  [INDC2013X08L]
L5  470nH 3.15A 36mOhm  [INDC2013X08L]
R17  20mOhm 1%  [RESC1005X04L]
R18  100k 1%  [RESC0603X03L]
R19  24k 1%  [RESC0603X03L]
R20  7.68k 1%  [RESC0603X03L]
R21  10k 1%  [RESC0603X03L]
R22  20mOhm 1%  [RESC1005X04L]
R23  100k 1%  [RESC0603X03L]
R24  24k 1%  [RESC0603X03L]
R25  19.1k 1%  [RESC0603X03L]
R26  20mOhm 1%  [RESC1005X04L]
R27  10k 1%  [RESC0603X03L]
R28  100k 1%  [RESC0603X03L]
R29  24k 1%  [RESC0603X03L]
R30  34.8k 1%  [RESC0603X03L]
R31  20mOhm 1%  [RESC1005X04L]
R32  100k 1%  [RESC0603X03L]
R33  100k 1%  [RESC0603X03L]
R34  24k 1%  [RESC0603X03L]
R35  95.3k 1%  [RESC0603X03L]
U2  FAN53541UCX  [BGA20C40P4X5_156X196X59]
U3  FAN53541UCX  [BGA20C40P4X5_156X196X59]
U4  PAC1934T-I/J6CX  [BGA16C50P4X4_222X217X68]
U5  FAN53541UCX  [BGA20C40P4X5_156X196X59]
U6  PAC1934T-I/J6CX  [BGA16C50P4X4_222X217X68]
U7  FAN53541UCX  [BGA20C40P4X5_156X196X59]
U14  TPS51206DSQR  [SON40P200X80_HS-11L_TPS]

### Ports
EN_VCC1.0 (in), I3V3_EXT- (in), IBUS_EXT+ (in), IBUS_EXT- (in), ISNS_BAT+ (in), ISNS_BAT- (in), IUSB+ (in), IUSB- (in), PWRM_MON_CTRL (harness PWRM_MON_CTRL), VSYS (in)

### Harnesses
PWRM_MON_CTRL: PAC1_SLOW/~{ALERT}, PAC_SCL, PAC1_~{PWRDN}, PAC_SDA, PAC2_SLOW/~{ALERT}, PAC2_~{PWRDN}

### Nets
GND: C5.2 C7.2 C8.2 C9.2 C10.2 C12.2 C13.2 C14.2 C15.2 C17.2 C18.2 C19.2 C21.2 C22.2 C37.2 C63.2 C64.2 C129.2 R20.1 R25.1 R30.1 R35.1 U2.B1(MODE) U2.B2(GND) U2.B3(GND) U2.B4(AGND) U2.C1(GND) U2.C2(GND) U2.C3(GND) U2.C4(GND) U3.B1(MODE) U3.B2(GND) U3.B3(GND) U3.B4(AGND) U3.C1(GND) U3.C2(GND) U3.C3(GND) U3.C4(GND) U4.B4(GND) U4.C2(ADDRSEL) U5.B1(MODE) U5.B2(GND) U5.B3(GND) U5.B4(AGND) U5.C1(GND) U5.C2(GND) U5.C3(GND) U5.C4(GND) U6.B4(GND) U7.B1(MODE) U7.B2(GND) U7.B3(GND) U7.B4(AGND) U7.C1(GND) U7.C2(GND) U7.C3(GND) U7.C4(GND) U14.4(PGND) U14.8(GND) U14.11(EXP)
VCC1.0: C22.1 R31.2 R34.2 U4.A2(SENSE1-)
VCC1.8: C13.1 R22.2 R24.2 U4.C1(SENSE3-)
VCC1.35: C18.1 C63.1 R26.2 R29.2 U4.D2(SENSE4-) U14.1(VDDQSNS) U14.2(VLDOIN) U14.7(S3) U14.9(S5)
VCC3.3: C8.1 C9.1 C14.1 C37.1 R17.2 R18.2 R19.2 R21.2 R27.2 U4.A4(VDD) U4.B1(SENSE2-) U4.B2(VDDIO) U6.A4(VDD) U6.B2(VDDIO) U6.C2(ADDRSEL) U6.D3(SENSE4+) U14.10(VCC)
VSYS: C5.1 C10.1 C15.1 C19.1 R23.2 R28.2 R32.2 R33.2 U2.D1(VIN) U2.D2(VIN) U2.E1(VIN) U2.E2(VIN) U3.D1(VIN) U3.D2(VIN) U3.E1(VIN) U3.E2(VIN) U5.D1(VIN) U5.D2(VIN) U5.E1(VIN) U5.E2(VIN) U7.D1(VIN) U7.D2(VIN) U7.E1(VIN) U7.E2(VIN) ; port VSYS
VTT: C129.1 U14.3(VTT) U14.5(VTTSNS)
VTTREF: C64.1 U14.6(VTTREF)
EN_VCC1.0: R33.1 U7.A2(EN) ; port EN_VCC1.0
FB_VCC1.0: R34.1 R35.2 U7.A3(FB)
FB_VCC1.8: R24.1 R25.2 U3.A3(FB)
FB_VCC1.35: R29.1 R30.2 U5.A3(FB)
FB_VCC3.3: R19.1 R20.2 U2.A3(FB)
PAC1_~{PWRDN}: U4.B3(~{PWRDN}) ; port PWRM_MON_CTRL.PAC1_~{PWRDN}
PAC1_SLOW/~{ALERT}: R21.1 U4.C3(SLOW/~{ALERT}) ; port PWRM_MON_CTRL.PAC1_SLOW/~{ALERT}
PAC2_~{PWRDN}: U6.B3(~{PWRDN}) ; port PWRM_MON_CTRL.PAC2_~{PWRDN}
PAC2_SLOW/~{ALERT}: R27.1 U6.C3(SLOW/~{ALERT}) ; port PWRM_MON_CTRL.PAC2_SLOW/~{ALERT}
PAC_SCL: U4.C4(SM_CLK) U6.C4(SM_CLK) ; port PWRM_MON_CTRL.PAC_SCL  [project net CHG_SCL]
PAC_SDA: U4.D4(SM_DATA) U6.D4(SM_DATA) ; port PWRM_MON_CTRL.PAC_SDA  [project net CHG_SDA]
PG_VCC1.0: R32.1 U3.A2(EN) U7.A1(PGOOD)
PG_VCC1.8: R23.1 U3.A1(PGOOD) U5.A2(EN)
PG_VCC1.35: R28.1 U2.A2(EN) U5.A1(PGOOD)
PG_VCC3.3: R18.1 U2.A1(PGOOD)
SW_VCC1.0: L5.1 U7.D3(SW) U7.D4(SW) U7.E3(SW) U7.E4(SW)
SW_VCC1.8: L3.1 U3.D3(SW) U3.D4(SW) U3.E3(SW) U3.E4(SW)
SW_VCC3.3: L2.1 U2.D3(SW) U2.D4(SW) U2.E3(SW) U2.E4(SW)
VBAT: U6.C1(SENSE3-) ; port ISNS_BAT-
VOUT_VCC1.0: C21.1 L5.2 R31.1 U4.A3(SENSE1+) U7.A4(VOUT)
VOUT_VCC1.8: C12.1 L3.2 R22.1 U3.A4(VOUT) U4.D1(SENSE3+)
VOUT_VCC3.3: C7.1 L2.2 R17.1 U2.A4(VOUT) U4.A1(SENSE2+)
NetC2_1: U6.A1(SENSE2+) U6.A2(SENSE1-) ; port IBUS_EXT+, port IUSB-
NetC17_1: C17.1 L4.2 R26.1 U4.D3(SENSE4+) U5.A4(VOUT)
NetC23_1: U6.D2(SENSE4-) ; port I3V3_EXT-
NetC24_1: U6.B1(SENSE2-) ; port IBUS_EXT-
NetJ4_28: U6.D1(SENSE3+) ; port ISNS_BAT+
NetL1_1: U6.A3(SENSE1+) ; port IUSB+
NetL4_1: L4.1 U5.D3(SW) U5.D4(SW) U5.E3(SW) U5.E4(SW)

### Notes on the sheet
- (near U2) 3.3V / 3.15A cont.
- (near U2) PWR Sequence: 4
- 16Bit 100mV FSR Power Monitor
- (near U3) 1.8V / 3.15A cont.
- (near U4) I2C address 0x20
- (near U3) PWR Sequence: 2
- (near U5) 1.35V / 3.15A cont.
- (near U6) I2C address 0x3E
- (near U5) PWR Sequence: 3
- (near U7) 1.0V / 3.15A cont.
- ISNS_BAT:
  Monitors Battery Current/Voltage
  IBUS_EXT:
  Monitors Current/Voltage on Feather VBUS pin
  ISUB:
  Monitors Current/Voltage on USB Input Connector
  I3V3_EXT:
  Monitors Current/Voltage on Feather VCC3.3 pin
- DDR Termination Regulatoir
- (near U7) PWR Sequence: 1
- FAN53541UCX Feedback divider:
  The summed power loss of the feedback dividers is 456µW
  Low resistance values were selected for bandwidth resasons
- EN Pin
  Pulling down EN_VCC1.0 starts the power down sequence of the system.
  The power down order is the inverse of the power up sequence.
  Floating the EN_VCC1.0 signal starts the power up sequence
- Power-On Sequence:
  Vccpint -> Vccpaux/Vccpl -> PSVcco (Vcco_mio0/Vcc_mio1/Vcc_ddr)
  VCC1.0 -> VCC1.8 -> VCC1.35 -> VCC3.3
  PS_POR_B low until all supplys are stable
- Labels drawn without touching a wire or pin: SW_VCC1.35, VOUT_VCC1.35
- Title:
- ++CONFIDENTIAL++
- The  information  contained  in  these  documents  is  confidential,  privileged  and  only  for  the
  information of the intended recipient and may
  not be used, published or redistributed without
  the prior written consent from PCB Arts GmbH.
- Datum:
- Revision:
- Blatt:
- von:
- Zeit:
- Entwickler:
- Checked:
- Der transparenteste Entwicklungsdienstleister
  der Elektronik- und Softwareentwicklung
- https://pcb-arts.com/
- mail@pcb-arts.com
- (in symbol CAP_0201_470nF_10V) 0201; X5R
- (in symbol CAP_0402_10µ_6.3V) 0402; X5R
- (in symbol RES_0201_7.68k_1%) 0201
- (in symbol RES_0201_10k_1%) 0201
- (in symbol RES_0201_19.1k_1%) 0201
- (in symbol RES_0201_24k_1%) 0201
- (in symbol RES_0201_34.8k_1%) 0201
- (in symbol RES_0201_95.3k_1%) 0201
- (in symbol RES_0201_100k_1%) 0201
- (in symbol RES_0402_20mR_1%) 0402

### Library data of the parts
C5 C7 C8 C10 C12 C13 C15 C17-C19 C21 C22 C63 C129 = CAP_0402_10µ_6.3V: as C2 on sheet 03_Battery Management; Manufacturer 2: Taiyo Yuden
C9 C14 C37 C64 = CAP_0201_470nF_10V: Multilayer Ceramic Capacitors MLCC - SMD/SMT 0201 10VDC; Manufacturer 1: Taiyo Yuden; Manufacturer 1 Prt. Nr.: LMK063BBJ474KPLF; Manufacturer 2 Prt. Nr.: C0603X5R1A474M030BC; Manufacturer 2: TDK
L2-L5 = IND_0805_470nH_3.15A: Fixed Inductors 0805 .47uH 3.15A 20% 36mOhms HiCur; Manufacturer Prt. Nr.: MCHK2012TR47M; Manufacturer: Taiyo Yuden
R17 R22 R26 R31 = RES_0402_20mR_1%: as R1 on sheet 02_Input Connectors
R18 R23 R28 R32 R33 = RES_0201_100k_1%: Thick Film Resistors - SMD 100K OHM 1%; Manufacturer 1: Yageo; Manufacturer 1 Prt. Nr.: RC0201FR-07100KL; Manufacturer 2 Prt. Nr.: CRCW0201100KFNED; Manufacturer 2: Vishay / Dale
R19 R24 R29 R34 = RES_0201_24k_1%: Thick Film Resistors - SMD 24K OHM 1%; Manufacturer 1: Yageo; Manufacturer 1 Prt. Nr.: RC0201FR-0724KL; Manufacturer 2 Prt. Nr.: CRCW020124K0FKED; Manufacturer 2: Vishay / Dale
R20 = RES_0201_7.68k_1%: Thick Film Resistors - SMD 7.68K OHM 1%; Manufacturer 1: Yageo; Manufacturer 1 Prt. Nr.: RC0201FR-077K68L; Manufacturer 2 Prt. Nr.: CRCW02017K68FKED; Manufacturer 2: Vishay / Dale
R21 R27 = RES_0201_10k_1%: as R7 on sheet 03_Battery Management; Manufacturer 2: Vishay / Dale
R25 = RES_0201_19.1k_1%: Thick Film Resistors - SMD 19.1K OHM 1%; Manufacturer 1: Yageo; Manufacturer 1 Prt. Nr.: RC0201FR-0719K1L; Manufacturer 2 Prt. Nr.: CRCW020119K1FKED; Manufacturer 2: Vishay / Dale
R30 = RES_0201_34.8k_1%: Thick Film Resistors - SMD 34.8K OHM 1%; Manufacturer 1: Yageo; Manufacturer 1 Prt. Nr.: RC0201FR-0734K8L; Manufacturer 2 Prt. Nr.: CRCW020134K8FKED; Manufacturer 2: Vishay / Dale
R35 = RES_0201_95.3k_1%: Thick Film Resistors - SMD 95.3K OHM 1%; Manufacturer 1: Yageo; Manufacturer 1 Prt. Nr.: RC0201FR-0795K3L; Manufacturer 2 Prt. Nr.: CRCW020195K3FKED; Manufacturer 2: Vishay / Dale
U2 U3 U5 U7 = FAN53541UCX_2.4 MHz 5A Synchronous Buck Reg: Switching Voltage Regulators 2.4 MHz 5A Synchronous Buck Reg; Manufacturer: ON Semiconductor / Fairchild; Manufacturer Prt. Nr.: FAN53541UCX
U4 U6 = PAC1934T-I/J6CX_Quad High-Side Current Sensor, I2C/SMBus: Current & Power Monitors & Regulators Quad High-Side Current Sensor, I2C/SMBus, 32V with Accumulator; Manufacturer 1: Microchip Technology; Manufacturer 1 Prt. Nr.: PAC1934T-I/J6CX
U14 = TPS51206DSQR_2A Peak Sink/Source DDR Term Reg: Power Management Specialised - PMIC 2A Peak Sink/Source DDR Term Reg; Manufacturer 1: Texas Instruments; Manufacturer 1 Prt. Nr.: TPS51206DSQR

## Sheet 05_Output Connectors.SchDoc
size A3; SheetNumber: 5; SheetTotal: 14
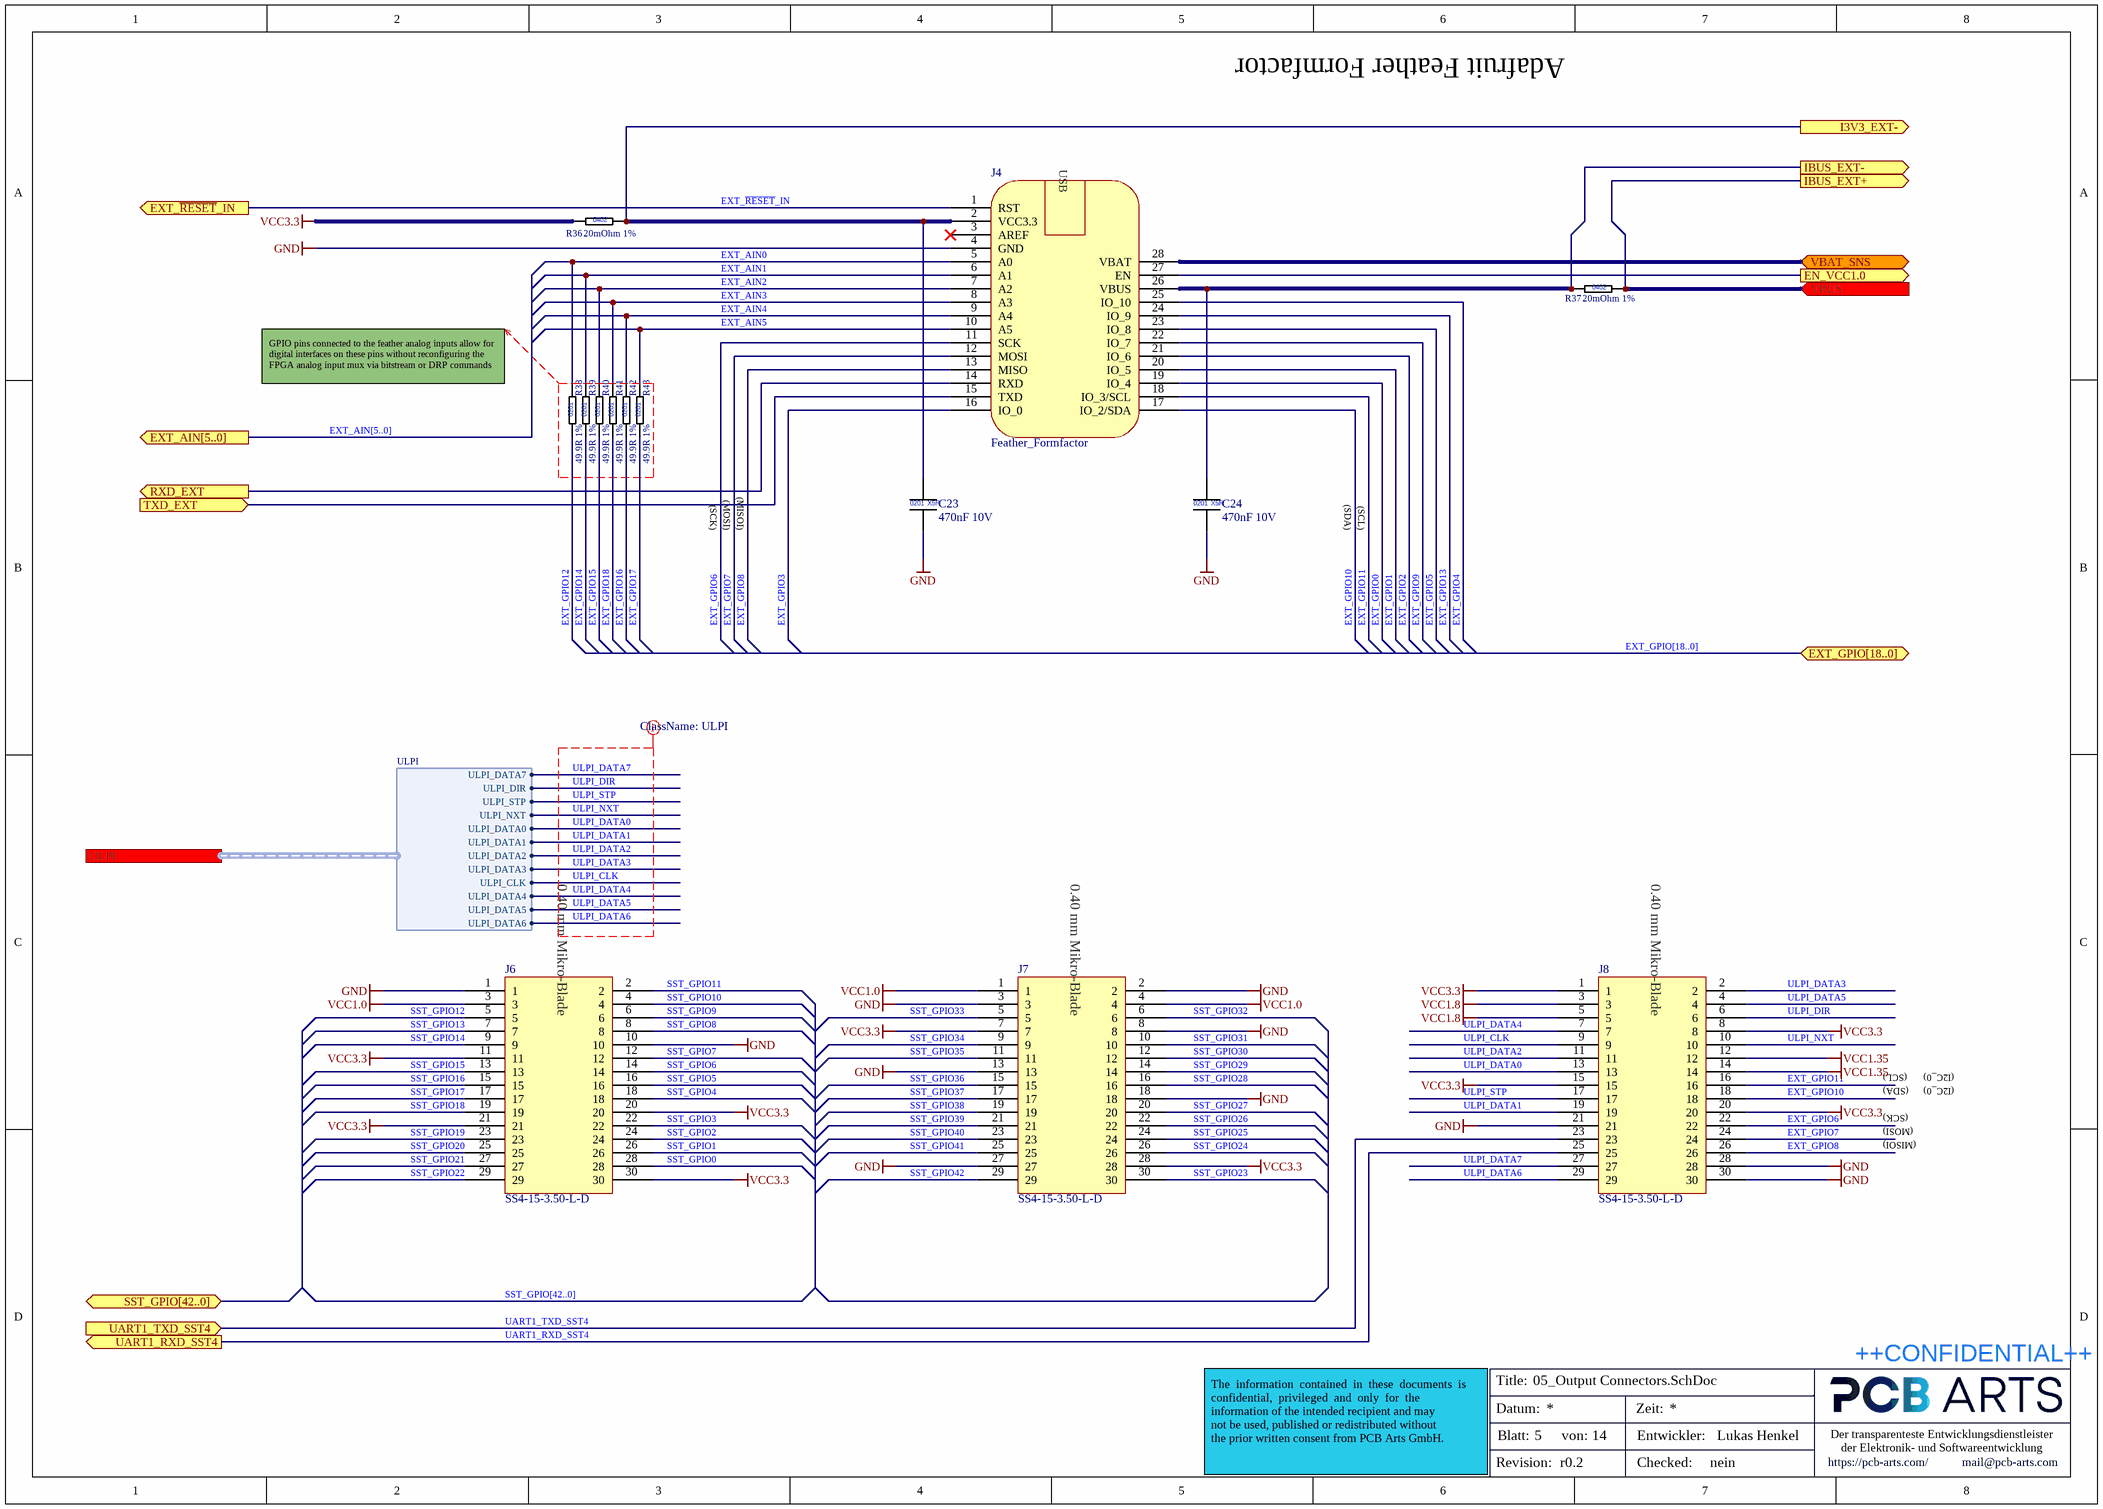
[diagram p5: 05_Output Connectors.SchDoc]

### Parts
C23  470nF 10V  [CAPC0603X03L]
C24  470nF 10V  [CAPC0603X03L]
J4  Feather_Formfactor  [Feather_FFC]  (no BOM)
J6  SS4-15-3.50-L-D  [SS4-15-3.50-L-D]
J7  SS4-15-3.50-L-D  [SS4-15-3.50-L-D]
J8  SS4-15-3.50-L-D  [SS4-15-3.50-L-D]
R36  20mOhm 1%  [RESC1005X04L]
R37  20mOhm 1%  [RESC1005X04L]
R38  49.9R 1%  [RESC0603X03L]
R39  49.9R 1%  [RESC0603X03L]
R40  49.9R 1%  [RESC0603X03L]
R41  49.9R 1%  [RESC0603X03L]
R42  49.9R 1%  [RESC0603X03L]
R43  49.9R 1%  [RESC0603X03L]

### Ports
EN_VCC1.0 (out), EXT_AIN[5..0] (out), EXT_GPIO[18..0] (bidir), EXT_~{RESET}_IN (out), I3V3_EXT- (out), IBUS_EXT+ (out), IBUS_EXT- (out), RXD_EXT (out), SST_GPIO[42..0] (bidir), TXD_EXT (in), UART1_RXD_SST4 (out), UART1_TXD_SST4 (in), ULPI (harness ULPI), VBAT_SNS (bidir), VBUS (in)

### Harnesses
ULPI: ULPI_DATA7, ULPI_DIR, ULPI_STP, ULPI_NXT, ULPI_DATA0, ULPI_DATA1, ULPI_DATA2, ULPI_DATA3, ULPI_CLK, ULPI_DATA4, ULPI_DATA5, ULPI_DATA6

### Nets
GND: C23.2 C24.2 J4.4(GND) J6.1 J6.10 J7.2 J7.3 J7.8 J7.13 J7.18 J7.27 J8.21 J8.28 J8.30
VCC1.0: J6.3 J7.1 J7.4
VCC1.8: J8.3 J8.5
VCC1.35: J8.12 J8.14
VCC3.3: J6.11 J6.20 J6.21 J6.30 J7.7 J7.28 J8.1 J8.8 J8.15 J8.20 R36.1
EN_VCC1.0: J4.27(EN) ; port EN_VCC1.0
EXT_AIN0: J4.5(A0) R38.2
EXT_AIN1: J4.6(A1) R39.2
EXT_AIN2: J4.7(A2) R40.2
EXT_AIN3: J4.8(A3) R41.2
EXT_AIN4: J4.9(A4) R42.2
EXT_AIN5: J4.10(A5) R43.2
EXT_GPIO0: J4.19(IO_4)
EXT_GPIO1: J4.20(IO_5)
EXT_GPIO2: J4.21(IO_6)
EXT_GPIO3: J4.16(IO_0)
EXT_GPIO4: J4.25(IO_10)
EXT_GPIO5: J4.23(IO_8)
EXT_GPIO6: J4.11(SCK) J8.22
EXT_GPIO7: J4.12(MOSI) J8.24
EXT_GPIO8: J4.13(MISO) J8.26
EXT_GPIO9: J4.22(IO_7)
EXT_GPIO10: J4.17(IO_2/SDA) J8.18
EXT_GPIO11: J4.18(IO_3/SCL) J8.16
EXT_GPIO12: R38.1
EXT_GPIO13: J4.24(IO_9)
EXT_GPIO14: R39.1
EXT_GPIO15: R40.1
EXT_GPIO16: R42.1
EXT_GPIO17: R43.1
EXT_GPIO18: R41.1
EXT_~{RESET}_IN: J4.1(RST) ; port EXT_~{RESET}_IN
SST_GPIO0: J6.28
SST_GPIO1: J6.26
SST_GPIO2: J6.24
SST_GPIO3: J6.22
SST_GPIO4: J6.18
SST_GPIO5: J6.16
SST_GPIO6: J6.14
SST_GPIO7: J6.12
SST_GPIO8: J6.8
SST_GPIO9: J6.6
SST_GPIO10: J6.4
SST_GPIO11: J6.2
SST_GPIO12: J6.5
SST_GPIO13: J6.7
SST_GPIO14: J6.9
SST_GPIO15: J6.13
SST_GPIO16: J6.15
SST_GPIO17: J6.17
SST_GPIO18: J6.19
SST_GPIO19: J6.23
SST_GPIO20: J6.25
SST_GPIO21: J6.27
SST_GPIO22: J6.29
SST_GPIO23: J7.30
SST_GPIO24: J7.26
SST_GPIO25: J7.24
SST_GPIO26: J7.22
SST_GPIO27: J7.20
SST_GPIO28: J7.16
SST_GPIO29: J7.14
SST_GPIO30: J7.12
SST_GPIO31: J7.10
SST_GPIO32: J7.6
SST_GPIO33: J7.5
SST_GPIO34: J7.9
SST_GPIO35: J7.11
SST_GPIO36: J7.15
SST_GPIO37: J7.17
SST_GPIO38: J7.19
SST_GPIO39: J7.21
SST_GPIO40: J7.23
SST_GPIO41: J7.25
SST_GPIO42: J7.29
UART1_RXD_SST4: J8.25 ; port UART1_RXD_SST4
UART1_TXD_SST4: J8.23 ; port UART1_TXD_SST4
UART_RXD: J4.14(RXD) ; port RXD_EXT
UART_TXD: J4.15(TXD) ; port TXD_EXT
ULPI_CLK: J8.9 ; port ULPI.ULPI_CLK
ULPI_DATA0: J8.13 ; port ULPI.ULPI_DATA0
ULPI_DATA1: J8.19 ; port ULPI.ULPI_DATA1
ULPI_DATA2: J8.11 ; port ULPI.ULPI_DATA2
ULPI_DATA3: J8.2 ; port ULPI.ULPI_DATA3
ULPI_DATA4: J8.7 ; port ULPI.ULPI_DATA4
ULPI_DATA5: J8.4 ; port ULPI.ULPI_DATA5
ULPI_DATA6: J8.29 ; port ULPI.ULPI_DATA6
ULPI_DATA7: J8.27 ; port ULPI.ULPI_DATA7
ULPI_DIR: J8.6 ; port ULPI.ULPI_DIR
ULPI_NXT: J8.10 ; port ULPI.ULPI_NXT
ULPI_STP: J8.17 ; port ULPI.ULPI_STP
NetC2_1: R37.2 ; port VBUS, port IBUS_EXT+
NetC23_1: C23.1 J4.2(VCC3.3) R36.2 ; port I3V3_EXT-
NetC24_1: C24.1 J4.26(VBUS) R37.1 ; port IBUS_EXT-
NetJ4_28: J4.28(VBAT) ; port VBAT_SNS

Not connected (* = marked no-connect by the designer): J4 3(AREF)*

### Buses and harness runs
bus EXT_AIN[5..0] = port EXT_AIN[5..0]
bus EXT_GPIO[18..0] = port EXT_GPIO[18..0]
bus SST_GPIO[42..0] = port SST_GPIO[42..0]

### Layout directives
net class ULPI: ULPI_CLK, ULPI_DATA0, ULPI_DATA1, ULPI_DATA2, ULPI_DATA3, ULPI_DATA4, ULPI_DATA5, ULPI_DATA6, ULPI_DATA7, ULPI_DIR, ULPI_NXT, ULPI_STP

### Notes on the sheet
- Adafruit Feather Formfactor
- GPIO pins connected to the feather analog inputs allow for digital interfaces on these pins without reconfiguring the FPGA analog input mux via bitstream or DRP commands
- (SCK)
- (MOSI)
- (MISOI)
- (SDA)
- (SCL)
- (I2C_0)
- Title:
- ++CONFIDENTIAL++
- Datum:
- Blatt:
- von:
- Zeit:
- Entwickler:
- Der transparenteste Entwicklungsdienstleister
  der Elektronik- und Softwareentwicklung
- The  information  contained  in  these  documents  is  confidential,  privileged  and  only  for  the
  information of the intended recipient and may
  not be used, published or redistributed without
  the prior written consent from PCB Arts GmbH.
- Revision:
- Checked:
- https://pcb-arts.com/
- mail@pcb-arts.com
- (in symbol CAP_0201_470nF_10V) 0201; X5R
- (in symbol Feather_Formfactor) USB
- (in symbol RES_0201_49.9R_1%) 0201
- (in symbol RES_0402_20mR_1%) 0402
- (in symbol SS4-15-3.50-L-D_0.40 mm Mikro-Blade & Beam) 0.40 mm Mikro-Blade

### Library data of the parts
C23 C24 = CAP_0201_470nF_10V: as C9 on sheet 04_Supply Monitoring; Manufacturer 2: TDK
J6-J8 = SS4-15-3.50-L-D_0.40 mm Mikro-Blade & Beam: 0.40 mm Mikro-Blade & Beam ultrafeine Raster-Stiftleiste; Manufacturer 1: Samtec; Manufacturer 1 Prt. Nr.: SS4-15-3.50-L-D
R36 R37 = RES_0402_20mR_1%: as R1 on sheet 02_Input Connectors
R38-R43 = RES_0201_49.9R_1%: Thick Film Resistors - SMD 49.9R OHM 1%; Manufacturer 1: Yageo; Manufacturer 1 Prt. Nr.: AC0201FR-0749R9L; Manufacturer 2 Prt. Nr.: CRCW020149R9FNED; Manufacturer 2: Vishay / Dale

## Sheet 06_USB-UART Bridge.SchDoc
size A3; SheetNumber: 6; SheetTotal: 14
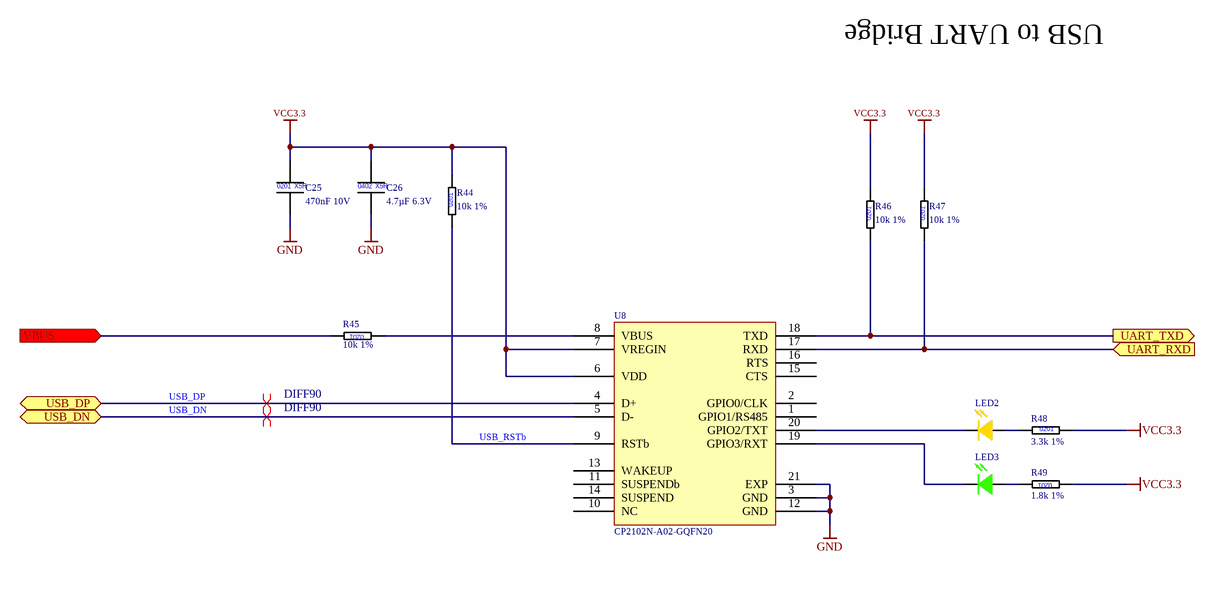
[diagram p6: 06_USB-UART Bridge.SchDoc]

### Parts
C25  470nF 10V  [CAPC0603X03L]
C26  4.7µF 6.3V  [CAPC1005X06L]
LED2  150040YS73220  [WL-SMCC_0402_H=0.25mm]  (value not drawn)
LED3  150040GS73220  [WL-SMCC_0402_H=0.25mm]  (value not drawn)
R44  10k 1%  [RESC0603X03L]
R45  10k 1%  [RESC0603X03L]
R46  10k 1%  [RESC0603X03L]
R47  10k 1%  [RESC0603X03L]
R48  3.3k 1%  [RESC0603X03L]
R49  1.8k 1%  [RESC0603X03L]
U8  CP2102N-A02-GQFN20  [QFN50P300X300X80_HS-17L]

### Ports
UART_RXD (in), UART_TXD (out), USB_DN (bidir), USB_DP (bidir), VBUS (in)

### Nets
GND: C25.2 C26.2 U8.3(GND) U8.12(GND) U8.21(EXP)
VCC3.3: C25.1 C26.1 R44.2 R46.2 R47.2 R48.2 R49.1 U8.6(VDD) U8.7(VREGIN)
UART_RXD: R47.1 U8.17(RXD) ; port UART_RXD
UART_TXD: R46.1 U8.18(TXD) ; port UART_TXD
USB_DN: U8.5(D-) ; port USB_DN  [project net USB_D_N]
USB_DP: U8.4(D+) ; port USB_DP  [project net USB_D_P]
USB_RSTb: R44.1 U8.9(RSTb)
NetC2_1: R45.2 ; port VBUS
NetLED2_1: LED2.1 U8.20(GPIO2/TXT)
NetLED2_2: LED2.2 R48.1
NetLED3_1: LED3.1 U8.19(GPIO3/RXT)
NetLED3_2: LED3.2 R49.2
NetR45_1: R45.1 U8.8(VBUS)

Not connected (* = marked no-connect by the designer): U8 1(GPIO1/RS485) 2(GPIO0/CLK) 10(NC) 11(SUSPENDb) 13(WAKEUP) 14(SUSPEND) 15(CTS) 16(RTS)

### Layout directives
differential pair; net class DIFF90: USB_D_N, USB_D_P

### Notes on the sheet
- USB to UART Bridge
- Title:
- ++CONFIDENTIAL++
- Datum:
- Blatt:
- von:
- Zeit:
- Entwickler:
- Der transparenteste Entwicklungsdienstleister
  der Elektronik- und Softwareentwicklung
- The  information  contained  in  these  documents  is  confidential,  privileged  and  only  for  the
  information of the intended recipient and may
  not be used, published or redistributed without
  the prior written consent from PCB Arts GmbH.
- Revision:
- Checked:
- https://pcb-arts.com/
- mail@pcb-arts.com
- (in symbol CAP_0201_470nF_10V) 0201; X5R
- (in symbol CAP_0402_4.7µ_6.3V) 0402; X5R
- (in symbol RES_0201_1.8k_1%) 0201
- (in symbol RES_0201_3.3k_1%) 0201
- (in symbol RES_0201_10k_1%) 0201

### Library data of the parts
C25 = CAP_0201_470nF_10V: as C9 on sheet 04_Supply Monitoring; Manufacturer 2: TDK
C26 = CAP_0402_4.7µ_6.3V: Multilayer Ceramic Capacitors MLCC - SMD/SMT 0402 6.3VDC; Manufacturer 1: Murata Electronics; Manufacturer 1 Prt. Nr.: GRM155R60J475ME47D; Manufacturer 2 Prt. Nr.: JMK105BC6475MV-F; Manufacturer 2: Taiyo Yuden
LED2 = 150040YS73220_SMD WL-SMCC SMT LED Mono-color: Standard LEDs - SMD WL-SMCC SMT LED Mono-color; Manufacturer 1: Wurth Elektronik; Manufacturer 1 Prt. Nr.: 150040YS73220
LED3 = 150040GS73220_SMD WL-SMCC SMT LED Mono-color: Standard LEDs - SMD WL-SMCC SMT LED Mono-color; Manufacturer 1: Wurth Elektronik; Manufacturer 1 Prt. Nr.: 150040GS73220
R44-R47 = RES_0201_10k_1%: as R7 on sheet 03_Battery Management; Manufacturer 2: Vishay / Dale
R48 = RES_0201_3.3k_1%: Thick Film Resistors - SMD 3.3K OHM 1%; Manufacturer 1: Panasonic; Manufacturer 1 Prt. Nr.: ERJ-1GNF3301C; Manufacturer 2 Prt. Nr.: CRCW02013K30FKED; Manufacturer 2: Vishay / Dale
R49 = RES_0201_1.8k_1%: as R8 on sheet 03_Battery Management; Manufacturer 2: Vishay / Dale
U8 = CP2102N-A02-GQFN20_USB Interface IC USB to UART bridge: USB Interface IC USB to UART bridge - QFN20; Manufacturer 1: Silicon Labs; Manufacturer 1 Prt. Nr.: CP2102N-A02-GQFN20

## Sheet 07_Analog Buffer.SchDoc
size A3; SheetNumber: 7; SheetTotal: 14
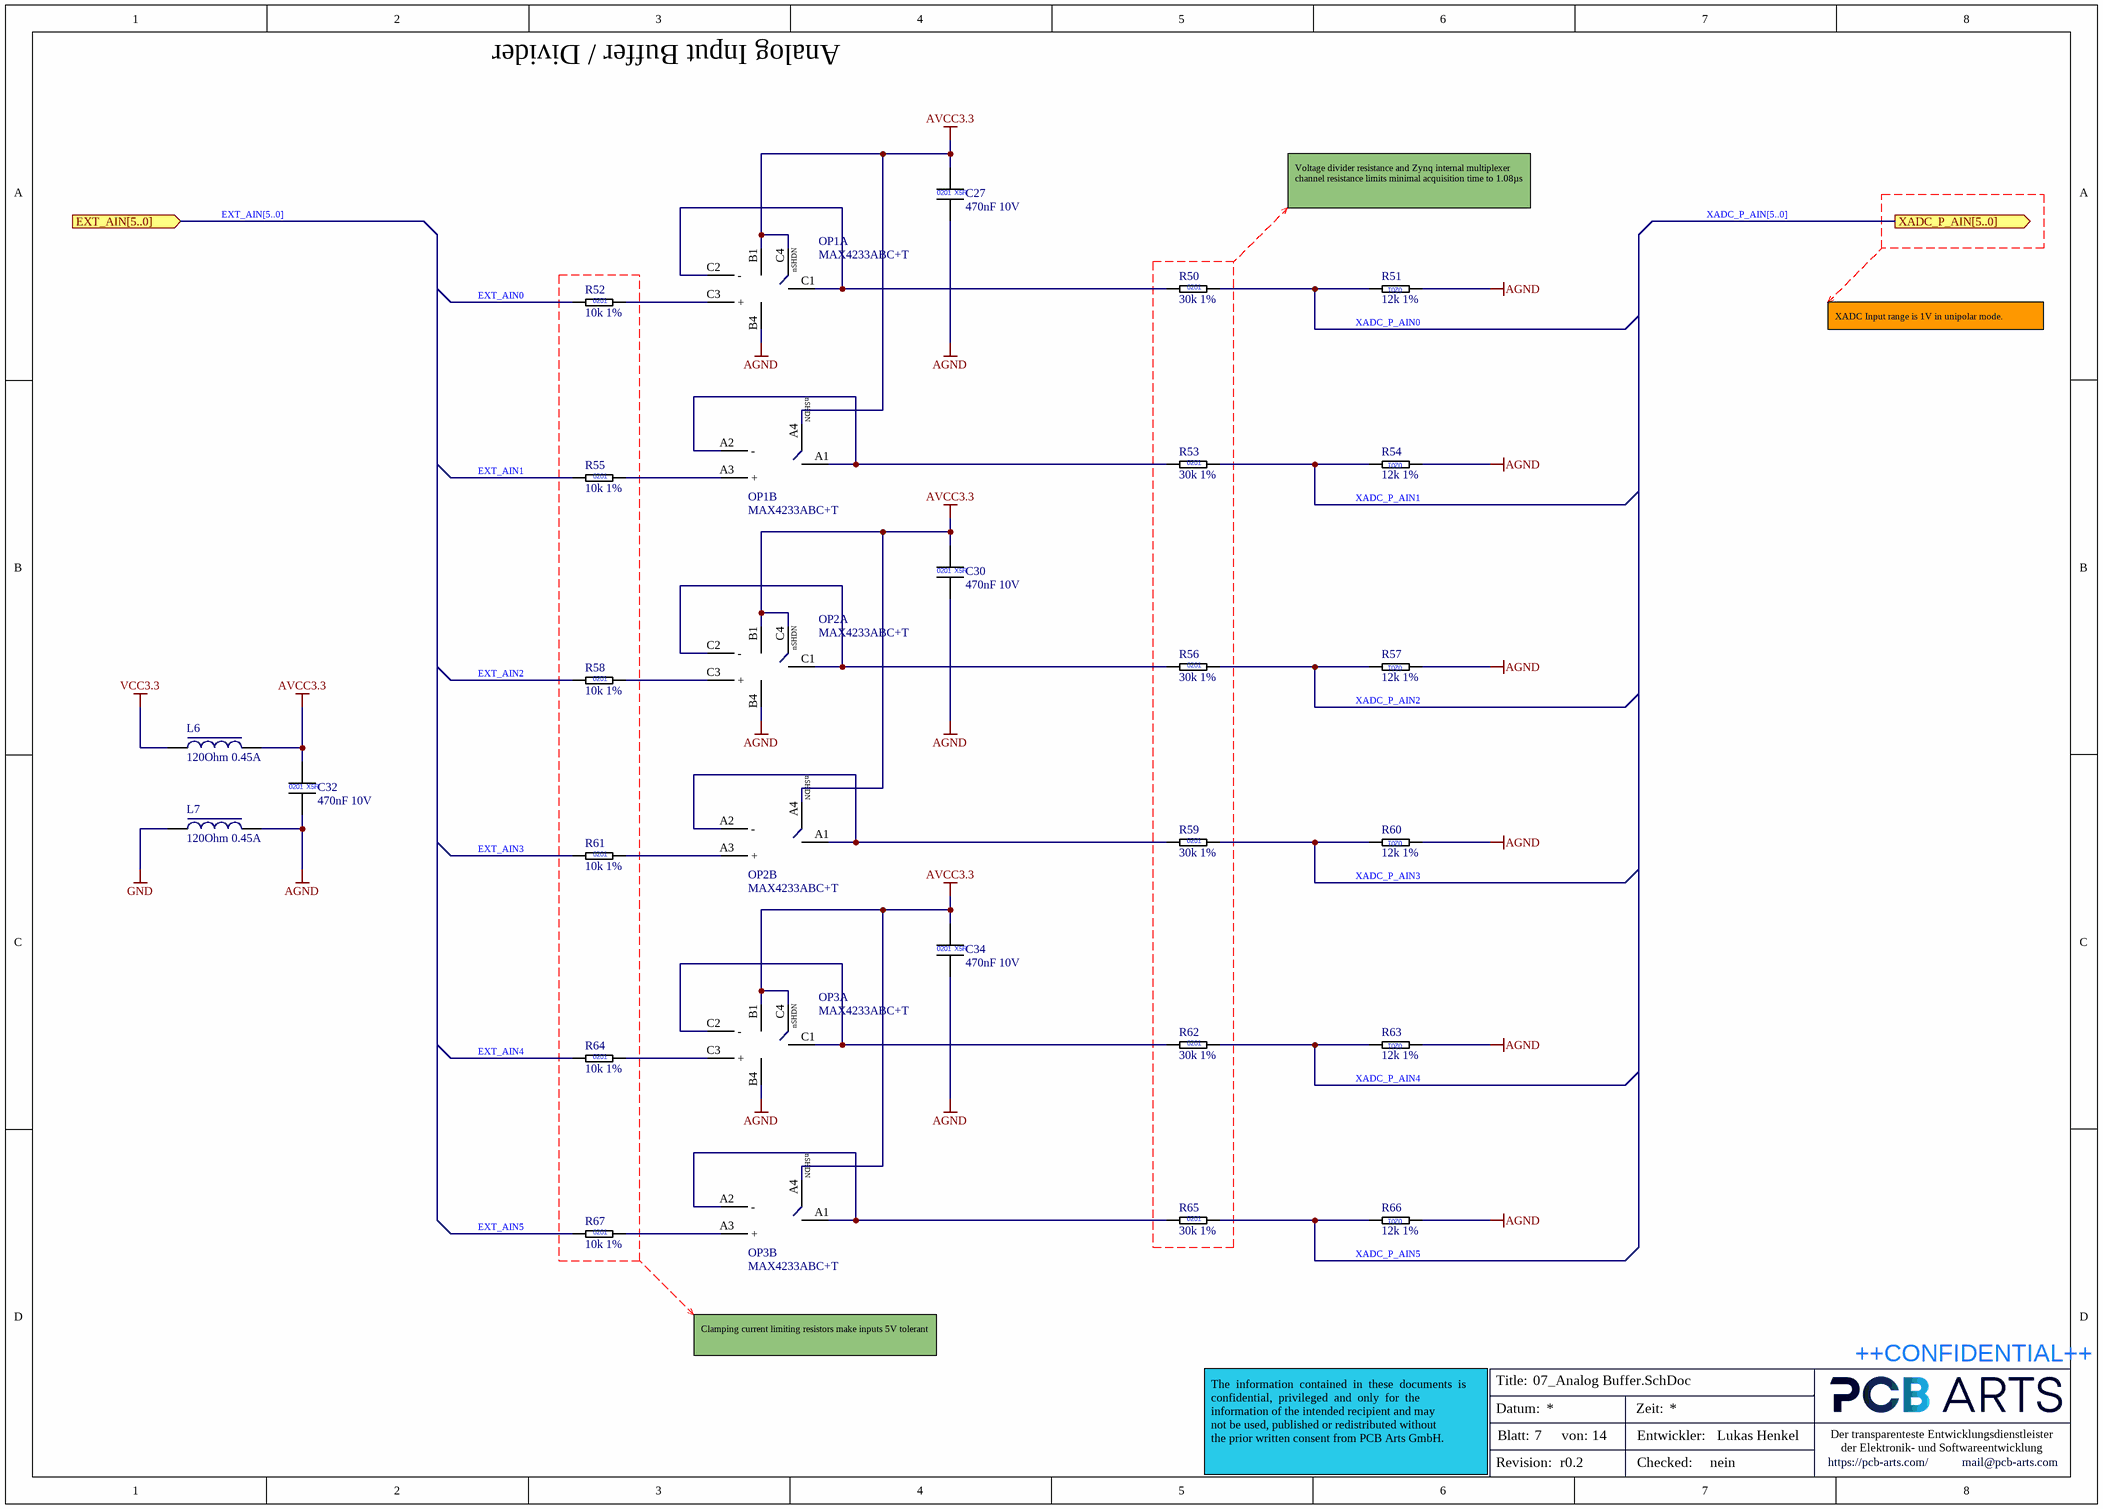
[diagram p7: 07_Analog Buffer.SchDoc]

### Parts
C27  470nF 10V  [CAPC0603X03L]
C30  470nF 10V  [CAPC0603X03L]
C32  470nF 10V  [CAPC0603X03L]
C34  470nF 10V  [CAPC0603X03L]
L6  120Ohm 0.45A  [INDC0603X03L]
L7  120Ohm 0.45A  [INDC0603X03L]
OP1  MAX4233ABC+T  [BGA10C50P4X3_202X154X69]  (parts A,B of 2)
OP2  MAX4233ABC+T  [BGA10C50P4X3_202X154X69]  (parts A,B of 2)
OP3  MAX4233ABC+T  [BGA10C50P4X3_202X154X69]  (parts A,B of 2)
R50  30k 1%  [RESC0603X03L]
R51  12k 1%  [RESC0603X03L]
R52  10k 1%  [RESC0603X03L]
R53  30k 1%  [RESC0603X03L]
R54  12k 1%  [RESC0603X03L]
R55  10k 1%  [RESC0603X03L]
R56  30k 1%  [RESC0603X03L]
R57  12k 1%  [RESC0603X03L]
R58  10k 1%  [RESC0603X03L]
R59  30k 1%  [RESC0603X03L]
R60  12k 1%  [RESC0603X03L]
R61  10k 1%  [RESC0603X03L]
R62  30k 1%  [RESC0603X03L]
R63  12k 1%  [RESC0603X03L]
R64  10k 1%  [RESC0603X03L]
R65  30k 1%  [RESC0603X03L]
R66  12k 1%  [RESC0603X03L]
R67  10k 1%  [RESC0603X03L]

### Ports
EXT_AIN[5..0] (in), XADC_P_AIN[5..0] (out)

### Nets
AGND: C27.2 C30.2 C32.2 C34.2 L7.2 OP1.B4(V-) OP2.B4(V-) OP3.B4(V-) R51.1 R54.1 R57.1 R60.1 R63.1 R66.1
AVCC3.3: C27.1 C30.1 C32.1 C34.1 L6.2 OP1.A4(~{SHDN}) OP1.B1(V+) OP1.C4(~{SHDN}) OP2.A4(~{SHDN}) OP2.B1(V+) OP2.C4(~{SHDN}) OP3.A4(~{SHDN}) OP3.B1(V+) OP3.C4(~{SHDN})
GND: L7.1
VCC3.3: L6.1
EXT_AIN0: R52.1
EXT_AIN1: R55.1
EXT_AIN2: R58.1
EXT_AIN3: R61.1
EXT_AIN4: R64.1
EXT_AIN5: R67.1
XADC_P_AIN0: R50.2 R51.2
XADC_P_AIN1: R53.2 R54.2
XADC_P_AIN2: R56.2 R57.2
XADC_P_AIN3: R59.2 R60.2
XADC_P_AIN4: R62.2 R63.2
XADC_P_AIN5: R65.2 R66.2
NetOP1_A1: OP1.A1(OUT_B) OP1.A2(-) R53.1
NetOP1_A3: OP1.A3(+) R55.2
NetOP1_C1: OP1.C1(OUT) OP1.C2(-) R50.1
NetOP1_C3: OP1.C3(+) R52.2
NetOP2_A1: OP2.A1(OUT_B) OP2.A2(-) R59.1
NetOP2_A3: OP2.A3(+) R61.2
NetOP2_C1: OP2.C1(OUT) OP2.C2(-) R56.1
NetOP2_C3: OP2.C3(+) R58.2
NetOP3_A1: OP3.A1(OUT_B) OP3.A2(-) R65.1
NetOP3_A3: OP3.A3(+) R67.2
NetOP3_C1: OP3.C1(OUT) OP3.C2(-) R62.1
NetOP3_C3: OP3.C3(+) R64.2

### Buses and harness runs
bus EXT_AIN[5..0] = port EXT_AIN[5..0]
bus XADC_P_AIN[5..0] = port XADC_P_AIN[5..0]

### Notes on the sheet
- Analog Input Buffer / Divider
- Voltage divider resistance and Zynq internal multiplexer channel resistance limits minimal acquisition time to 1.08µs
- XADC Input range is 1V in unipolar mode.
- Clamping current limiting resistors make inputs 5V tolerant
- Title:
- ++CONFIDENTIAL++
- Datum:
- Blatt:
- von:
- Zeit:
- Entwickler:
- Der transparenteste Entwicklungsdienstleister
  der Elektronik- und Softwareentwicklung
- The  information  contained  in  these  documents  is  confidential,  privileged  and  only  for  the
  information of the intended recipient and may
  not be used, published or redistributed without
  the prior written consent from PCB Arts GmbH.
- Revision:
- Checked:
- https://pcb-arts.com/
- mail@pcb-arts.com
- (in symbol CAP_0201_470nF_10V) 0201; X5R
- (in symbol MAX4233ABC+T_High-Output-Drive, 10MHz, 10V/μs,Rail-to-Rail I/O Op Amp, part A) nSHDN
- (in symbol MAX4233ABC+T_High-Output-Drive, 10MHz, 10V/μs,Rail-to-Rail I/O Op Amp, part B) nSHDN
- (in symbol RES_0201_10k_1%) 0201
- (in symbol RES_0201_12k_1%) 0201
- (in symbol RES_0201_30k_1%) 0201

### Library data of the parts
C27 C30 C32 C34 = CAP_0201_470nF_10V: as C9 on sheet 04_Supply Monitoring; Manufacturer 2: TDK
L6 L7 = FLT_0201_120Ohm_0.45A: Ferrite Bead 0201 120Ohm 0.45A 25%; Manufacturer Prt. Nr.: BK0603HR121-T; Manufacturer: Taiyo Yuden
OP1-OP3 = MAX4233ABC+T_High-Output-Drive, 10MHz, 10V/μs,Rail-to-Rail I/O Op Amp: High-Output-Drive, 10MHz, 10V/μs,Rail-to-Rail I/O Op Amps with Shutdown; Manufacturer: Maxim Integrated; Manufacturer Prt. Nr.: MAX4233ABC+T
R50 R53 R56 R59 R62 R65 = RES_0201_30k_1%: as R95 on sheet 03_Battery Management; Manufacturer 2: Vishay / Dale
R51 R54 R57 R60 R63 R66 = RES_0201_12k_1%: Thick Film Resistors - SMD 12K OHM 1%; Manufacturer 1: Yageo; Manufacturer 1 Prt. Nr.: RC0201FR-0712KL; Manufacturer 2 Prt. Nr.: CRCW020112K0FKED; Manufacturer 2: Vishay / Dale
R52 R55 R58 R61 R64 R67 = RES_0201_10k_1%: as R7 on sheet 03_Battery Management; Manufacturer 2: Vishay / Dale

## Sheet 08_Zynq Config_ADC.SchDoc
size A3; SheetNumber: 8; SheetTotal: 14
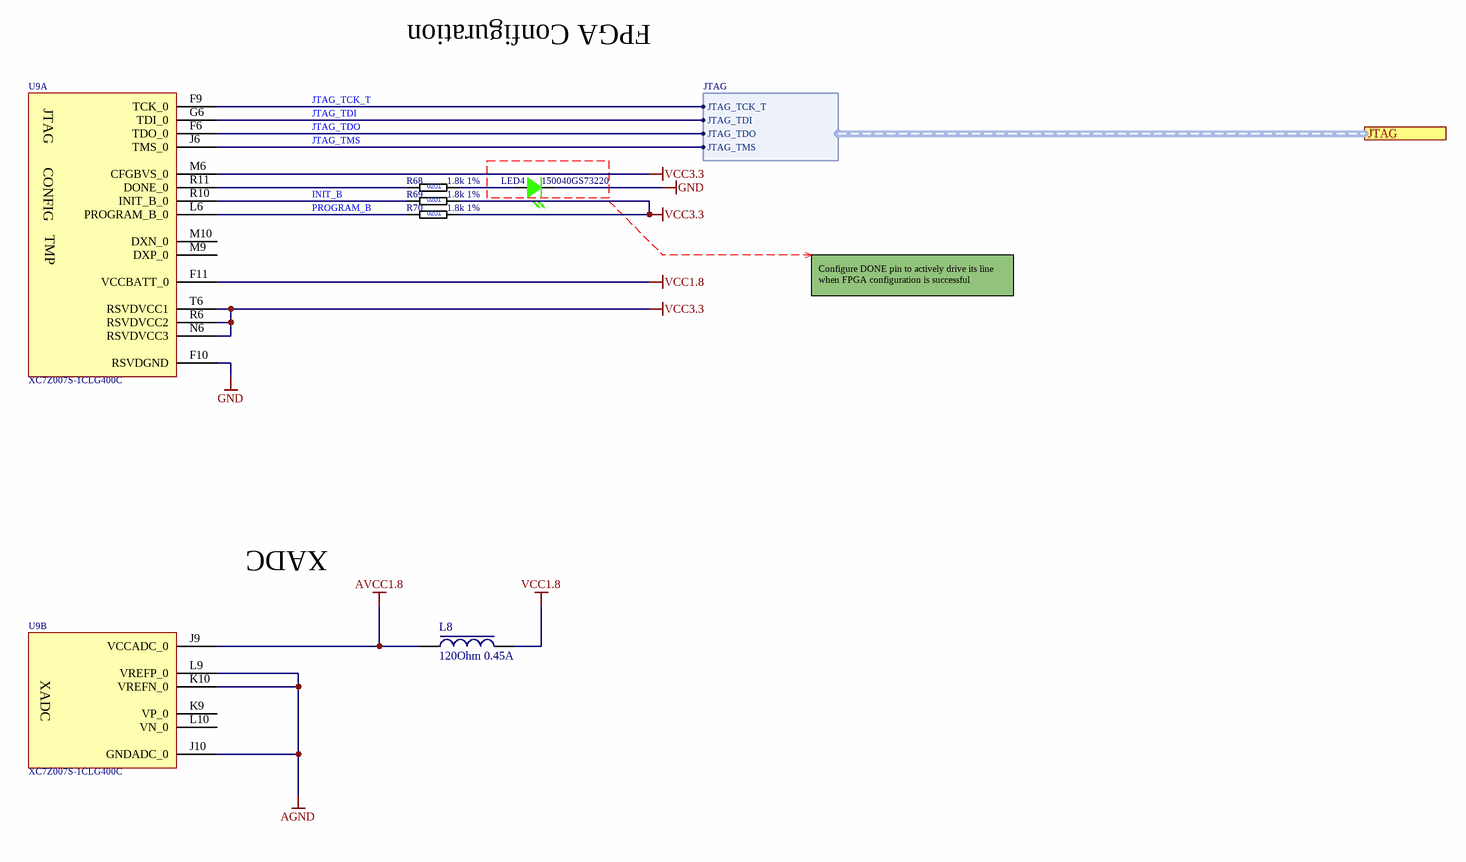
[diagram p8: 08_Zynq Config_ADC.SchDoc]

### Parts
L8  120Ohm 0.45A  [INDC0603X03L]
LED4  150040GS73220  [WL-SMCC_0402_H=0.25mm]
R68  1.8k 1%  [RESC0603X03L]
R69  1.8k 1%  [RESC0603X03L]
R70  1.8k 1%  [RESC0603X03L]
U9  XC7Z007S-1CLG400C  [BGA400C80P20X20_1700X1700X160]  (parts A,B of 8)

### Ports
JTAG (harness JTAG)

### Harnesses
JTAG: JTAG_TMS, JTAG_TDO, JTAG_TDI, JTAG_TCK_T

### Nets
AGND: U9.J10(GNDADC_0) U9.K10(VREFN_0) U9.L9(VREFP_0)
AVCC1.8: L8.2 U9.J9(VCCADC_0)
GND: LED4.1 U9.F10(RSVDGND)
VCC1.8: L8.1 U9.F11(VCCBATT_0)
VCC3.3: R69.2 R70.2 U9.M6(CFGBVS_0) U9.N6(RSVDVCC3) U9.R6(RSVDVCC2) U9.T6(RSVDVCC1)
INIT_B: R69.1 U9.R10(INIT_B_0)
JTAG_TCK_T: U9.F9(TCK_0) ; port JTAG.JTAG_TCK_T
JTAG_TDI: U9.G6(TDI_0) ; port JTAG.JTAG_TDI
JTAG_TDO: U9.F6(TDO_0) ; port JTAG.JTAG_TDO
JTAG_TMS: U9.J6(TMS_0) ; port JTAG.JTAG_TMS
PROGRAM_B: R70.1 U9.L6(PROGRAM_B_0)
NetLED4_2: LED4.2 R68.2
NetR68_1: R68.1 U9.R11(DONE_0)

Not connected (* = marked no-connect by the designer): U9 K9(VP_0) L10(VN_0) M9(DXP_0) M10(DXN_0)

### Notes on the sheet
- FPGA Configuration
- Configure DONE pin to actively drive its line when FPGA configuration is successful
- XADC
- Title:
- ++CONFIDENTIAL++
- Datum:
- Blatt:
- von:
- Zeit:
- Entwickler:
- Der transparenteste Entwicklungsdienstleister
  der Elektronik- und Softwareentwicklung
- The  information  contained  in  these  documents  is  confidential,  privileged  and  only  for  the
  information of the intended recipient and may
  not be used, published or redistributed without
  the prior written consent from PCB Arts GmbH.
- Revision:
- Checked:
- https://pcb-arts.com/
- mail@pcb-arts.com
- (in symbol RES_0201_1.8k_1%) 0201
- (in symbol XC7Z007S-1CLG400C_Processors - Application Specialised, part A) JTAG; CONFIG; TMP
- (in symbol XC7Z007S-1CLG400C_Processors - Application Specialised, part B) XADC

### Library data of the parts
L8 = FLT_0201_120Ohm_0.45A: as L6 on sheet 07_Analog Buffer
LED4 = 150040GS73220_SMD WL-SMCC SMT LED Mono-color: as LED3 on sheet 06_USB-UART Bridge; Manufacturer 1 Prt. Nr.: 150040GS73220
R68-R70 = RES_0201_1.8k_1%: as R8 on sheet 03_Battery Management; Manufacturer 2: Vishay / Dale
U9 = XC7Z007S-1CLG400C_Processors - Application Specialised: Manufacturer 1: Xilinx; Manufacturer 1 Prt. Nr.: XC7Z007S-1CLG400C

## Sheet 09_Zynq DDR.SchDoc
size A3; SheetNumber: 9; SheetTotal: 14
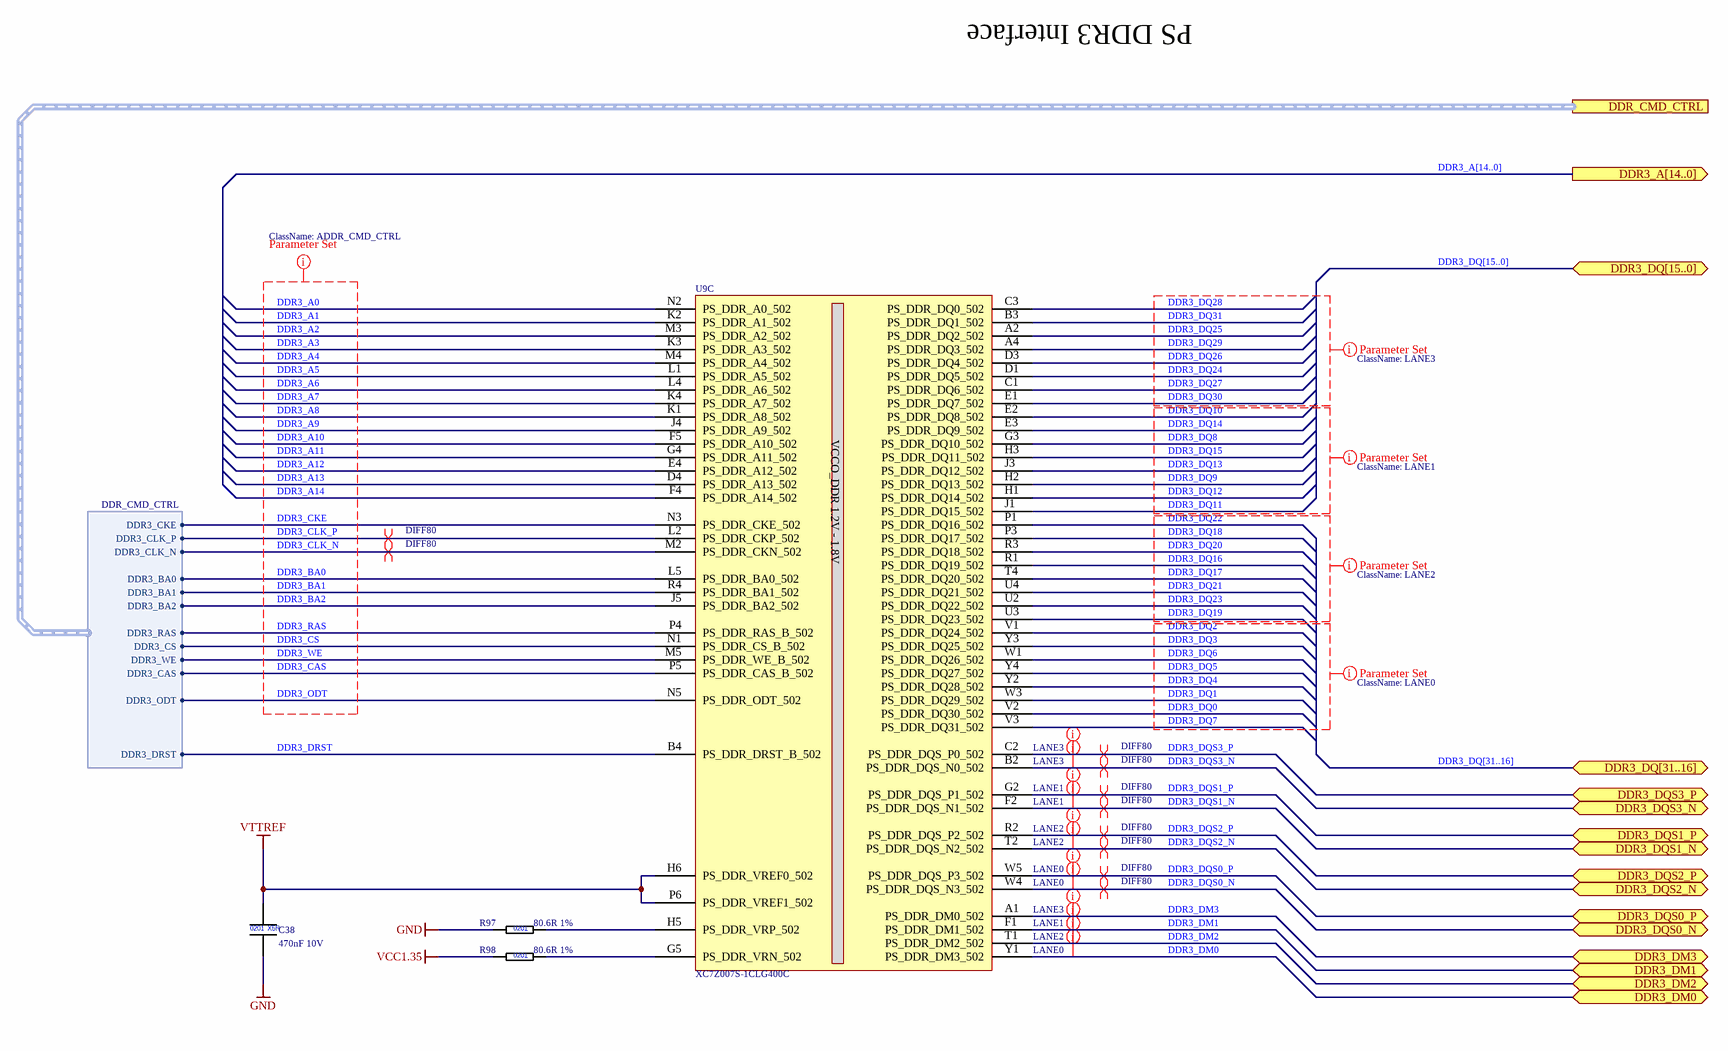
[diagram p9: 09_Zynq DDR.SchDoc]

### Parts
C38  470nF 10V  [CAPC0603X03L]
R97  80.6R 1%  [RESC0603X03L]
R98  80.6R 1%  [RESC0603X03L]
U9  XC7Z007S-1CLG400C  [BGA400C80P20X20_1700X1700X160]  (part C of 8)

### Ports
DDR3_A[14..0] (out), DDR3_DM0 (bidir), DDR3_DM1 (bidir), DDR3_DM2 (bidir), DDR3_DM3 (bidir), DDR3_DQ[15..0] (bidir), DDR3_DQ[31..16] (bidir), DDR3_DQS0_N (bidir), DDR3_DQS0_P (bidir), DDR3_DQS1_N (bidir), DDR3_DQS1_P (bidir), DDR3_DQS2_N (bidir), DDR3_DQS2_P (bidir), DDR3_DQS3_N (bidir), DDR3_DQS3_P (bidir), DDR_CMD_CTRL (harness DDR_CMD_CTRL)

### Harnesses
DDR_CMD_CTRL: DDR3_CLK_P, DDR3_CLK_N, DDR3_CKE, DDR3_BA0, DDR3_BA1, DDR3_RAS, DDR3_CS, DDR3_WE, DDR3_CAS, DDR3_BA2, DDR3_ODT, DDR3_DRST

### Nets
GND: C38.2 R97.1
VCC1.35: R98.1
VTTREF: C38.1 U9.H6(PS_DDR_VREF0_502) U9.P6(PS_DDR_VREF1_502)
DDR3_A0: U9.N2(PS_DDR_A0_502)
DDR3_A1: U9.K2(PS_DDR_A1_502)
DDR3_A2: U9.M3(PS_DDR_A2_502)
DDR3_A3: U9.K3(PS_DDR_A3_502)
DDR3_A4: U9.M4(PS_DDR_A4_502)
DDR3_A5: U9.L1(PS_DDR_A5_502)
DDR3_A6: U9.L4(PS_DDR_A6_502)
DDR3_A7: U9.K4(PS_DDR_A7_502)
DDR3_A8: U9.K1(PS_DDR_A8_502)
DDR3_A9: U9.J4(PS_DDR_A9_502)
DDR3_A10: U9.F5(PS_DDR_A10_502)
DDR3_A11: U9.G4(PS_DDR_A11_502)
DDR3_A12: U9.E4(PS_DDR_A12_502)
DDR3_A13: U9.D4(PS_DDR_A13_502)
DDR3_A14: U9.F4(PS_DDR_A14_502)
DDR3_BA0: U9.L5(PS_DDR_BA0_502) ; port DDR_CMD_CTRL.DDR3_BA0
DDR3_BA1: U9.R4(PS_DDR_BA1_502) ; port DDR_CMD_CTRL.DDR3_BA1
DDR3_BA2: U9.J5(PS_DDR_BA2_502) ; port DDR_CMD_CTRL.DDR3_BA2
DDR3_CAS: U9.P5(PS_DDR_CAS_B_502) ; port DDR_CMD_CTRL.DDR3_CAS
DDR3_CKE: U9.N3(PS_DDR_CKE_502) ; port DDR_CMD_CTRL.DDR3_CKE
DDR3_CLK_N: U9.M2(PS_DDR_CKN_502) ; port DDR_CMD_CTRL.DDR3_CLK_N
DDR3_CLK_P: U9.L2(PS_DDR_CKP_502) ; port DDR_CMD_CTRL.DDR3_CLK_P
DDR3_CS: U9.N1(PS_DDR_CS_B_502) ; port DDR_CMD_CTRL.DDR3_CS
DDR3_DM0: U9.Y1(PS_DDR_DM3_502) ; port DDR3_DM0
DDR3_DM1: U9.F1(PS_DDR_DM1_502) ; port DDR3_DM1
DDR3_DM2: U9.T1(PS_DDR_DM2_502) ; port DDR3_DM2
DDR3_DM3: U9.A1(PS_DDR_DM0_502) ; port DDR3_DM3
DDR3_DQ0: U9.V2(PS_DDR_DQ30_502)
DDR3_DQ1: U9.W3(PS_DDR_DQ29_502)
DDR3_DQ2: U9.V1(PS_DDR_DQ24_502)
DDR3_DQ3: U9.Y3(PS_DDR_DQ25_502)
DDR3_DQ4: U9.Y2(PS_DDR_DQ28_502)
DDR3_DQ5: U9.Y4(PS_DDR_DQ27_502)
DDR3_DQ6: U9.W1(PS_DDR_DQ26_502)
DDR3_DQ7: U9.V3(PS_DDR_DQ31_502)
DDR3_DQ8: U9.G3(PS_DDR_DQ10_502)
DDR3_DQ9: U9.H2(PS_DDR_DQ13_502)
DDR3_DQ10: U9.E2(PS_DDR_DQ8_502)
DDR3_DQ11: U9.J1(PS_DDR_DQ15_502)
DDR3_DQ12: U9.H1(PS_DDR_DQ14_502)
DDR3_DQ13: U9.J3(PS_DDR_DQ12_502)
DDR3_DQ14: U9.E3(PS_DDR_DQ9_502)
DDR3_DQ15: U9.H3(PS_DDR_DQ11_502)
DDR3_DQ16: U9.R1(PS_DDR_DQ19_502)
DDR3_DQ17: U9.T4(PS_DDR_DQ20_502)
DDR3_DQ18: U9.P3(PS_DDR_DQ17_502)
DDR3_DQ19: U9.U3(PS_DDR_DQ23_502)
DDR3_DQ20: U9.R3(PS_DDR_DQ18_502)
DDR3_DQ21: U9.U4(PS_DDR_DQ21_502)
DDR3_DQ22: U9.P1(PS_DDR_DQ16_502)
DDR3_DQ23: U9.U2(PS_DDR_DQ22_502)
DDR3_DQ24: U9.D1(PS_DDR_DQ5_502)
DDR3_DQ25: U9.A2(PS_DDR_DQ2_502)
DDR3_DQ26: U9.D3(PS_DDR_DQ4_502)
DDR3_DQ27: U9.C1(PS_DDR_DQ6_502)
DDR3_DQ28: U9.C3(PS_DDR_DQ0_502)
DDR3_DQ29: U9.A4(PS_DDR_DQ3_502)
DDR3_DQ30: U9.E1(PS_DDR_DQ7_502)
DDR3_DQ31: U9.B3(PS_DDR_DQ1_502)
DDR3_DQS0_N: U9.W4(PS_DDR_DQS_N3_502) ; port DDR3_DQS0_N
DDR3_DQS0_P: U9.W5(PS_DDR_DQS_P3_502) ; port DDR3_DQS0_P
DDR3_DQS1_N: U9.F2(PS_DDR_DQS_N1_502) ; port DDR3_DQS1_N
DDR3_DQS1_P: U9.G2(PS_DDR_DQS_P1_502) ; port DDR3_DQS1_P
DDR3_DQS2_N: U9.T2(PS_DDR_DQS_N2_502) ; port DDR3_DQS2_N
DDR3_DQS2_P: U9.R2(PS_DDR_DQS_P2_502) ; port DDR3_DQS2_P
DDR3_DQS3_N: U9.B2(PS_DDR_DQS_N0_502) ; port DDR3_DQS3_N
DDR3_DQS3_P: U9.C2(PS_DDR_DQS_P0_502) ; port DDR3_DQS3_P
DDR3_DRST: U9.B4(PS_DDR_DRST_B_502) ; port DDR_CMD_CTRL.DDR3_DRST
DDR3_ODT: U9.N5(PS_DDR_ODT_502) ; port DDR_CMD_CTRL.DDR3_ODT
DDR3_RAS: U9.P4(PS_DDR_RAS_B_502) ; port DDR_CMD_CTRL.DDR3_RAS
DDR3_WE: U9.M5(PS_DDR_WE_B_502) ; port DDR_CMD_CTRL.DDR3_WE
NetR97_2: R97.2 U9.H5(PS_DDR_VRP_502)
NetR98_2: R98.2 U9.G5(PS_DDR_VRN_502)

### Buses and harness runs
bus DDR3_A[14..0] = port DDR3_A[14..0]
bus DDR3_DQ[15..0] = port DDR3_DQ[15..0]
bus DDR3_DQ[31..16] = port DDR3_DQ[31..16]

### Layout directives
differential pair; net class DIFF80: DDR3_CLK_N, DDR3_CLK_P, DDR3_DQS0_N, DDR3_DQS0_P, DDR3_DQS1_N, DDR3_DQS1_P, DDR3_DQS2_N, DDR3_DQS2_P, DDR3_DQS3_N, DDR3_DQS3_P
net class LANE0: DDR3_DM0, DDR3_DQ0, DDR3_DQ1, DDR3_DQ2, DDR3_DQ3, DDR3_DQ4, DDR3_DQ5, DDR3_DQ6, DDR3_DQ7, DDR3_DQS0_N, DDR3_DQS0_P
net class LANE1: DDR3_DM1, DDR3_DQ8, DDR3_DQ9, DDR3_DQ10, DDR3_DQ11, DDR3_DQ12, DDR3_DQ13, DDR3_DQ14, DDR3_DQ15, DDR3_DQS1_N, DDR3_DQS1_P
net class LANE2: DDR3_DM2, DDR3_DQ16, DDR3_DQ17, DDR3_DQ18, DDR3_DQ19, DDR3_DQ20, DDR3_DQ21, DDR3_DQ22, DDR3_DQ23, DDR3_DQS2_N, DDR3_DQS2_P
net class LANE3: DDR3_DM3, DDR3_DQ24, DDR3_DQ25, DDR3_DQ26, DDR3_DQ27, DDR3_DQ28, DDR3_DQ29, DDR3_DQ30, DDR3_DQ31, DDR3_DQS3_N, DDR3_DQS3_P
net class ADDR_CMD_CTRL: DDR3_A0, DDR3_A1, DDR3_A2, DDR3_A3, DDR3_A4, DDR3_A5, DDR3_A6, DDR3_A7, DDR3_A8, DDR3_A9, DDR3_A10, DDR3_A11, DDR3_A12, DDR3_A13, DDR3_A14, DDR3_BA0, DDR3_BA1, DDR3_BA2, DDR3_CAS, DDR3_CKE, DDR3_CLK_N, DDR3_CLK_P, DDR3_CS, DDR3_ODT, DDR3_RAS, DDR3_WE

### Notes on the sheet
- PS DDR3 Interface
- Title:
- ++CONFIDENTIAL++
- Datum:
- Blatt:
- von:
- Zeit:
- Entwickler:
- Der transparenteste Entwicklungsdienstleister
  der Elektronik- und Softwareentwicklung
- The  information  contained  in  these  documents  is  confidential,  privileged  and  only  for  the
  information of the intended recipient and may
  not be used, published or redistributed without
  the prior written consent from PCB Arts GmbH.
- Revision:
- Checked:
- https://pcb-arts.com/
- mail@pcb-arts.com
- (in symbol CAP_0201_470nF_10V) 0201; X5R
- (in symbol RES_0201_80.6R_1%) 0201
- (in symbol XC7Z007S-1CLG400C_Processors - Application Specialised, part C) VCCO_DDR 1.2V - 1.8V

### Library data of the parts
C38 = CAP_0201_470nF_10V: as C9 on sheet 04_Supply Monitoring; Manufacturer 2: TDK
R97 R98 = RES_0201_80.6R_1%: Thick Film Resistors - SMD 80.6R OHM 1%; Manufacturer 1: Yageo; Manufacturer 1 Prt. Nr.: RC0201FR-0780R6L; Manufacturer 2 Prt. Nr.: CRCW020180R6FKED; Manufacturer 2: Vishay / Dale
U9 = XC7Z007S-1CLG400C_Processors - Application Specialised: Manufacturer 1: Xilinx; Manufacturer 1 Prt. Nr.: XC7Z007S-1CLG400C